# EAGLE board M7104B (EAGLE 6.6.0), part 1 of 3
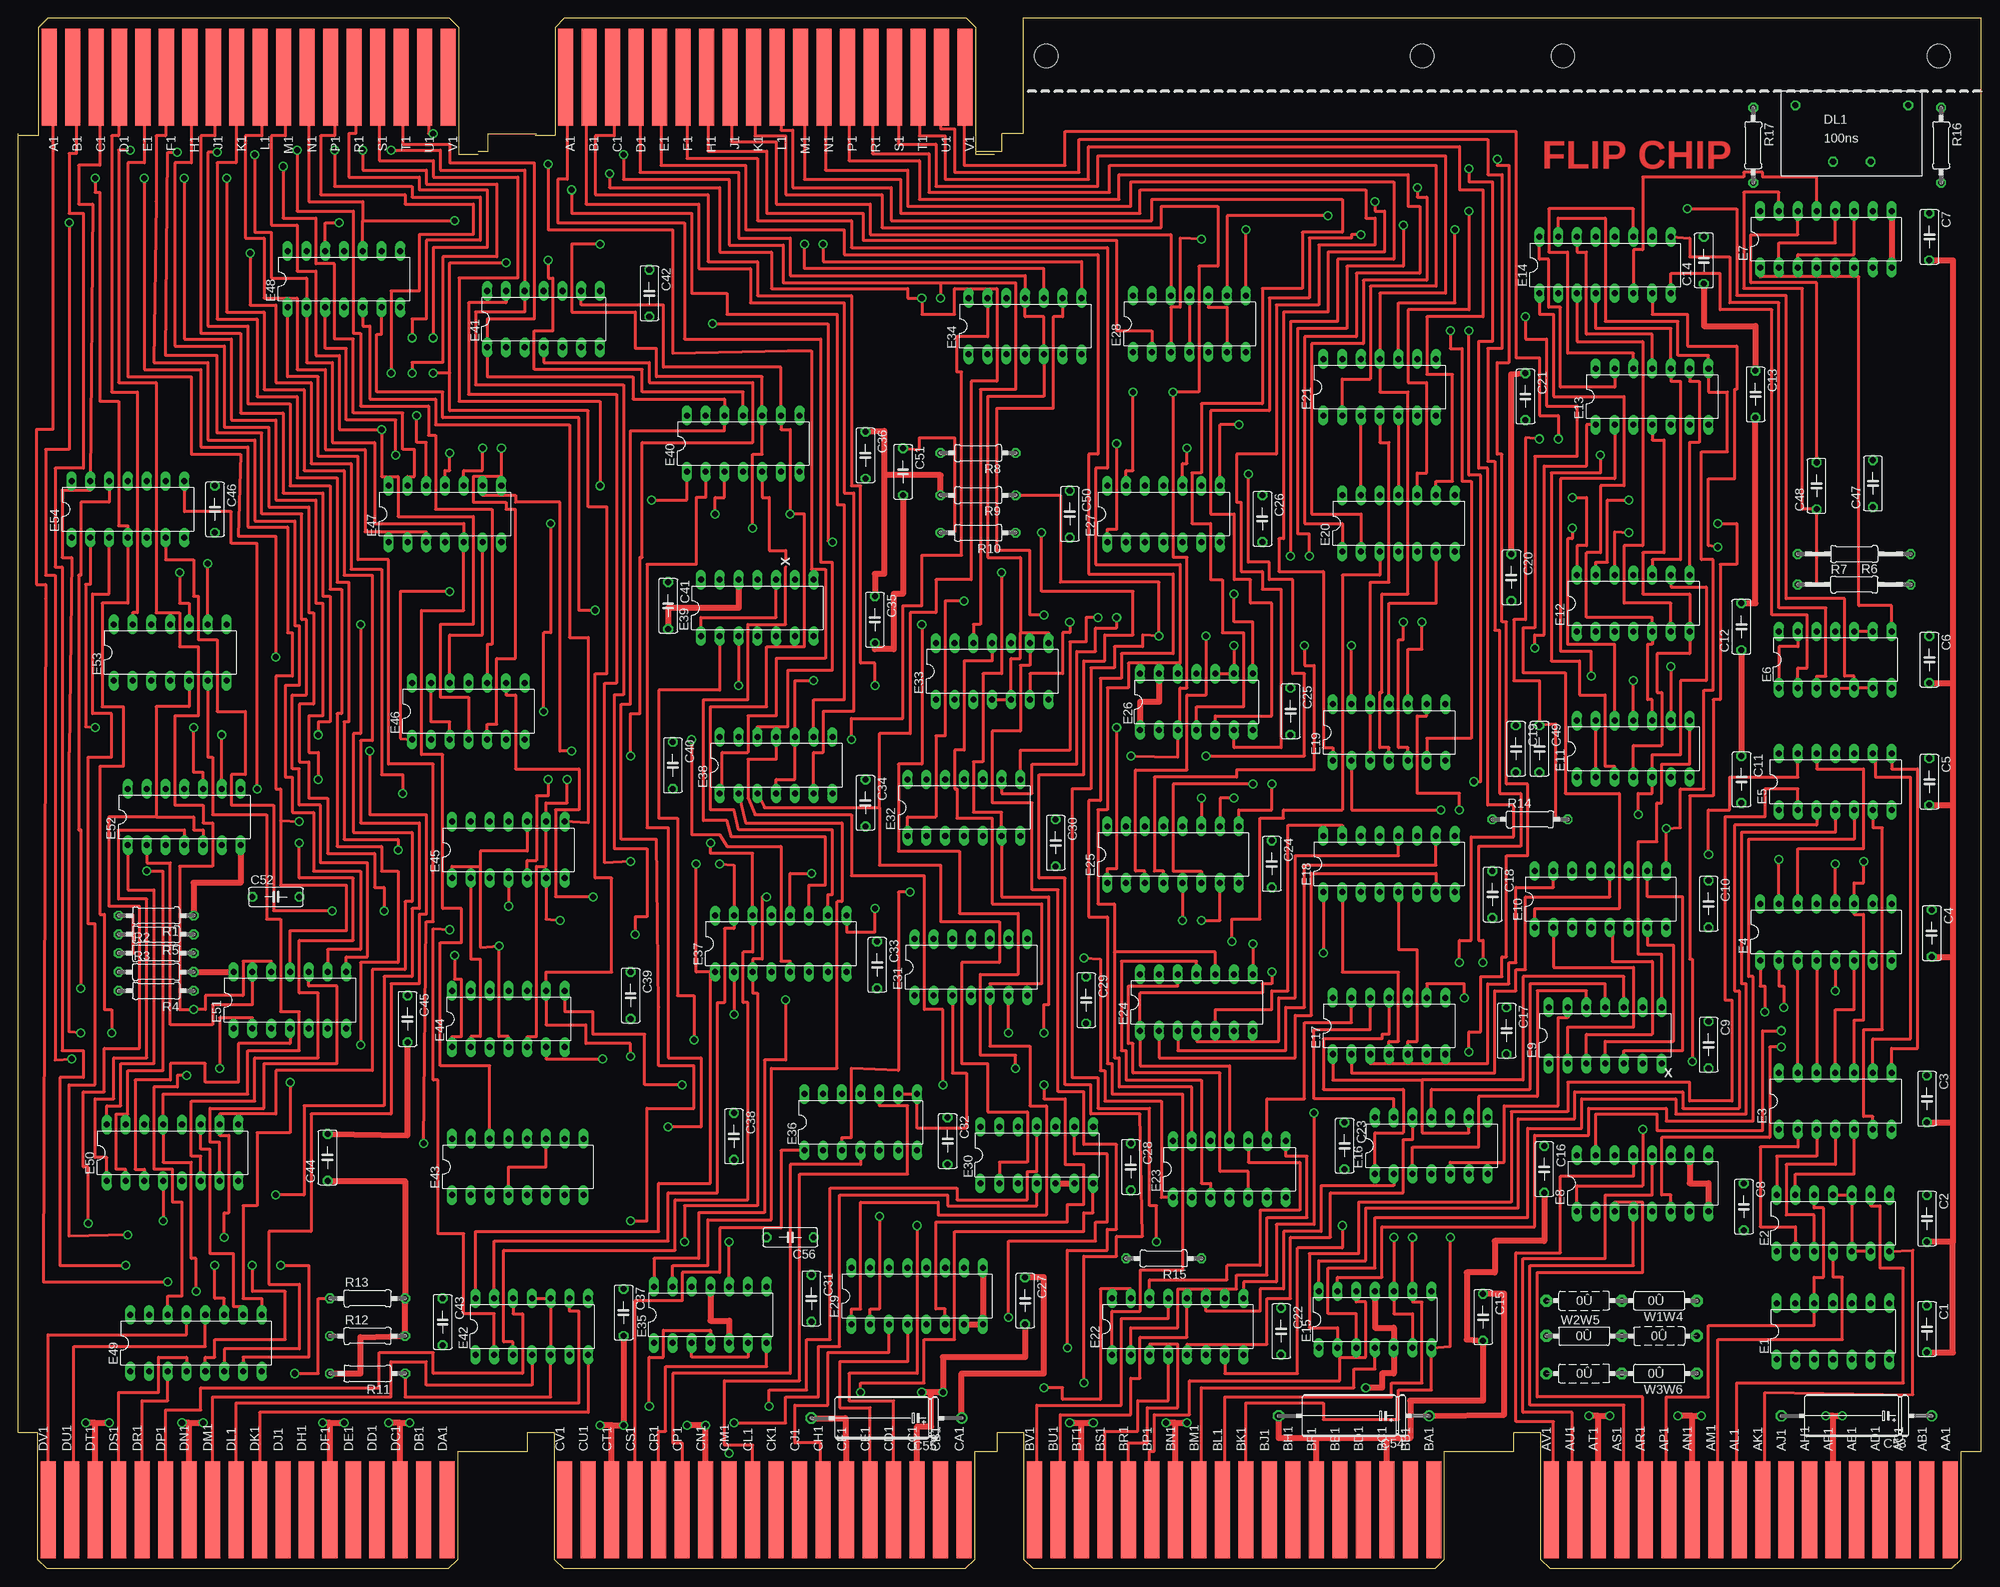
[diagram p5: board, top side]
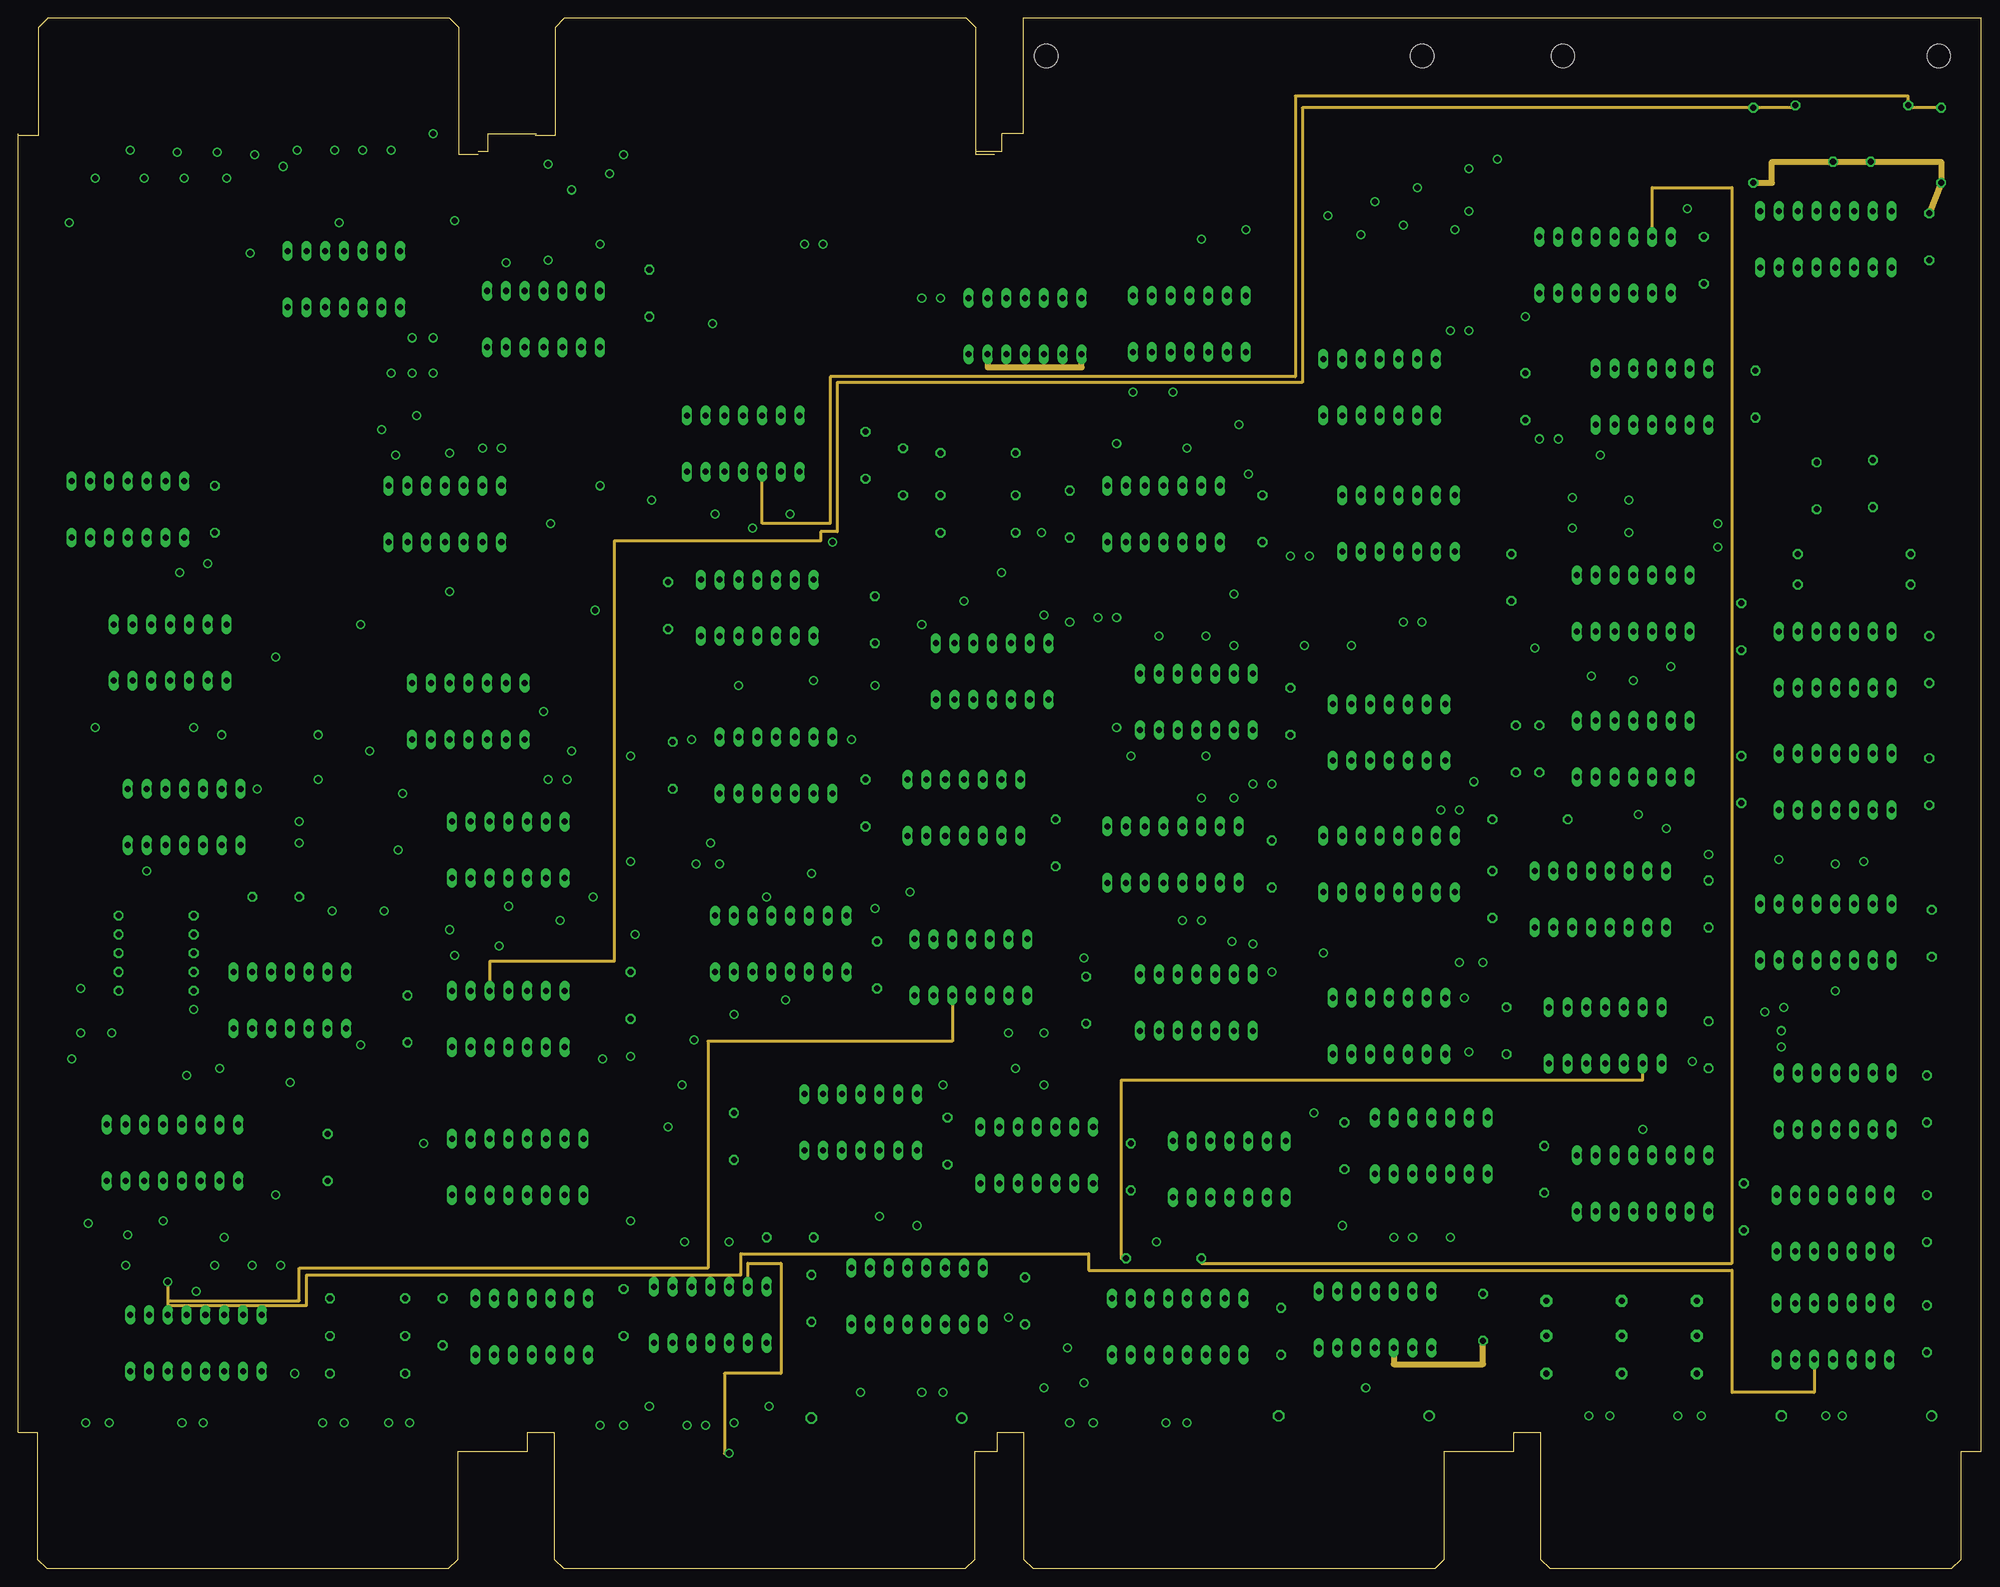
[diagram p6: board, inner layer ECO1]
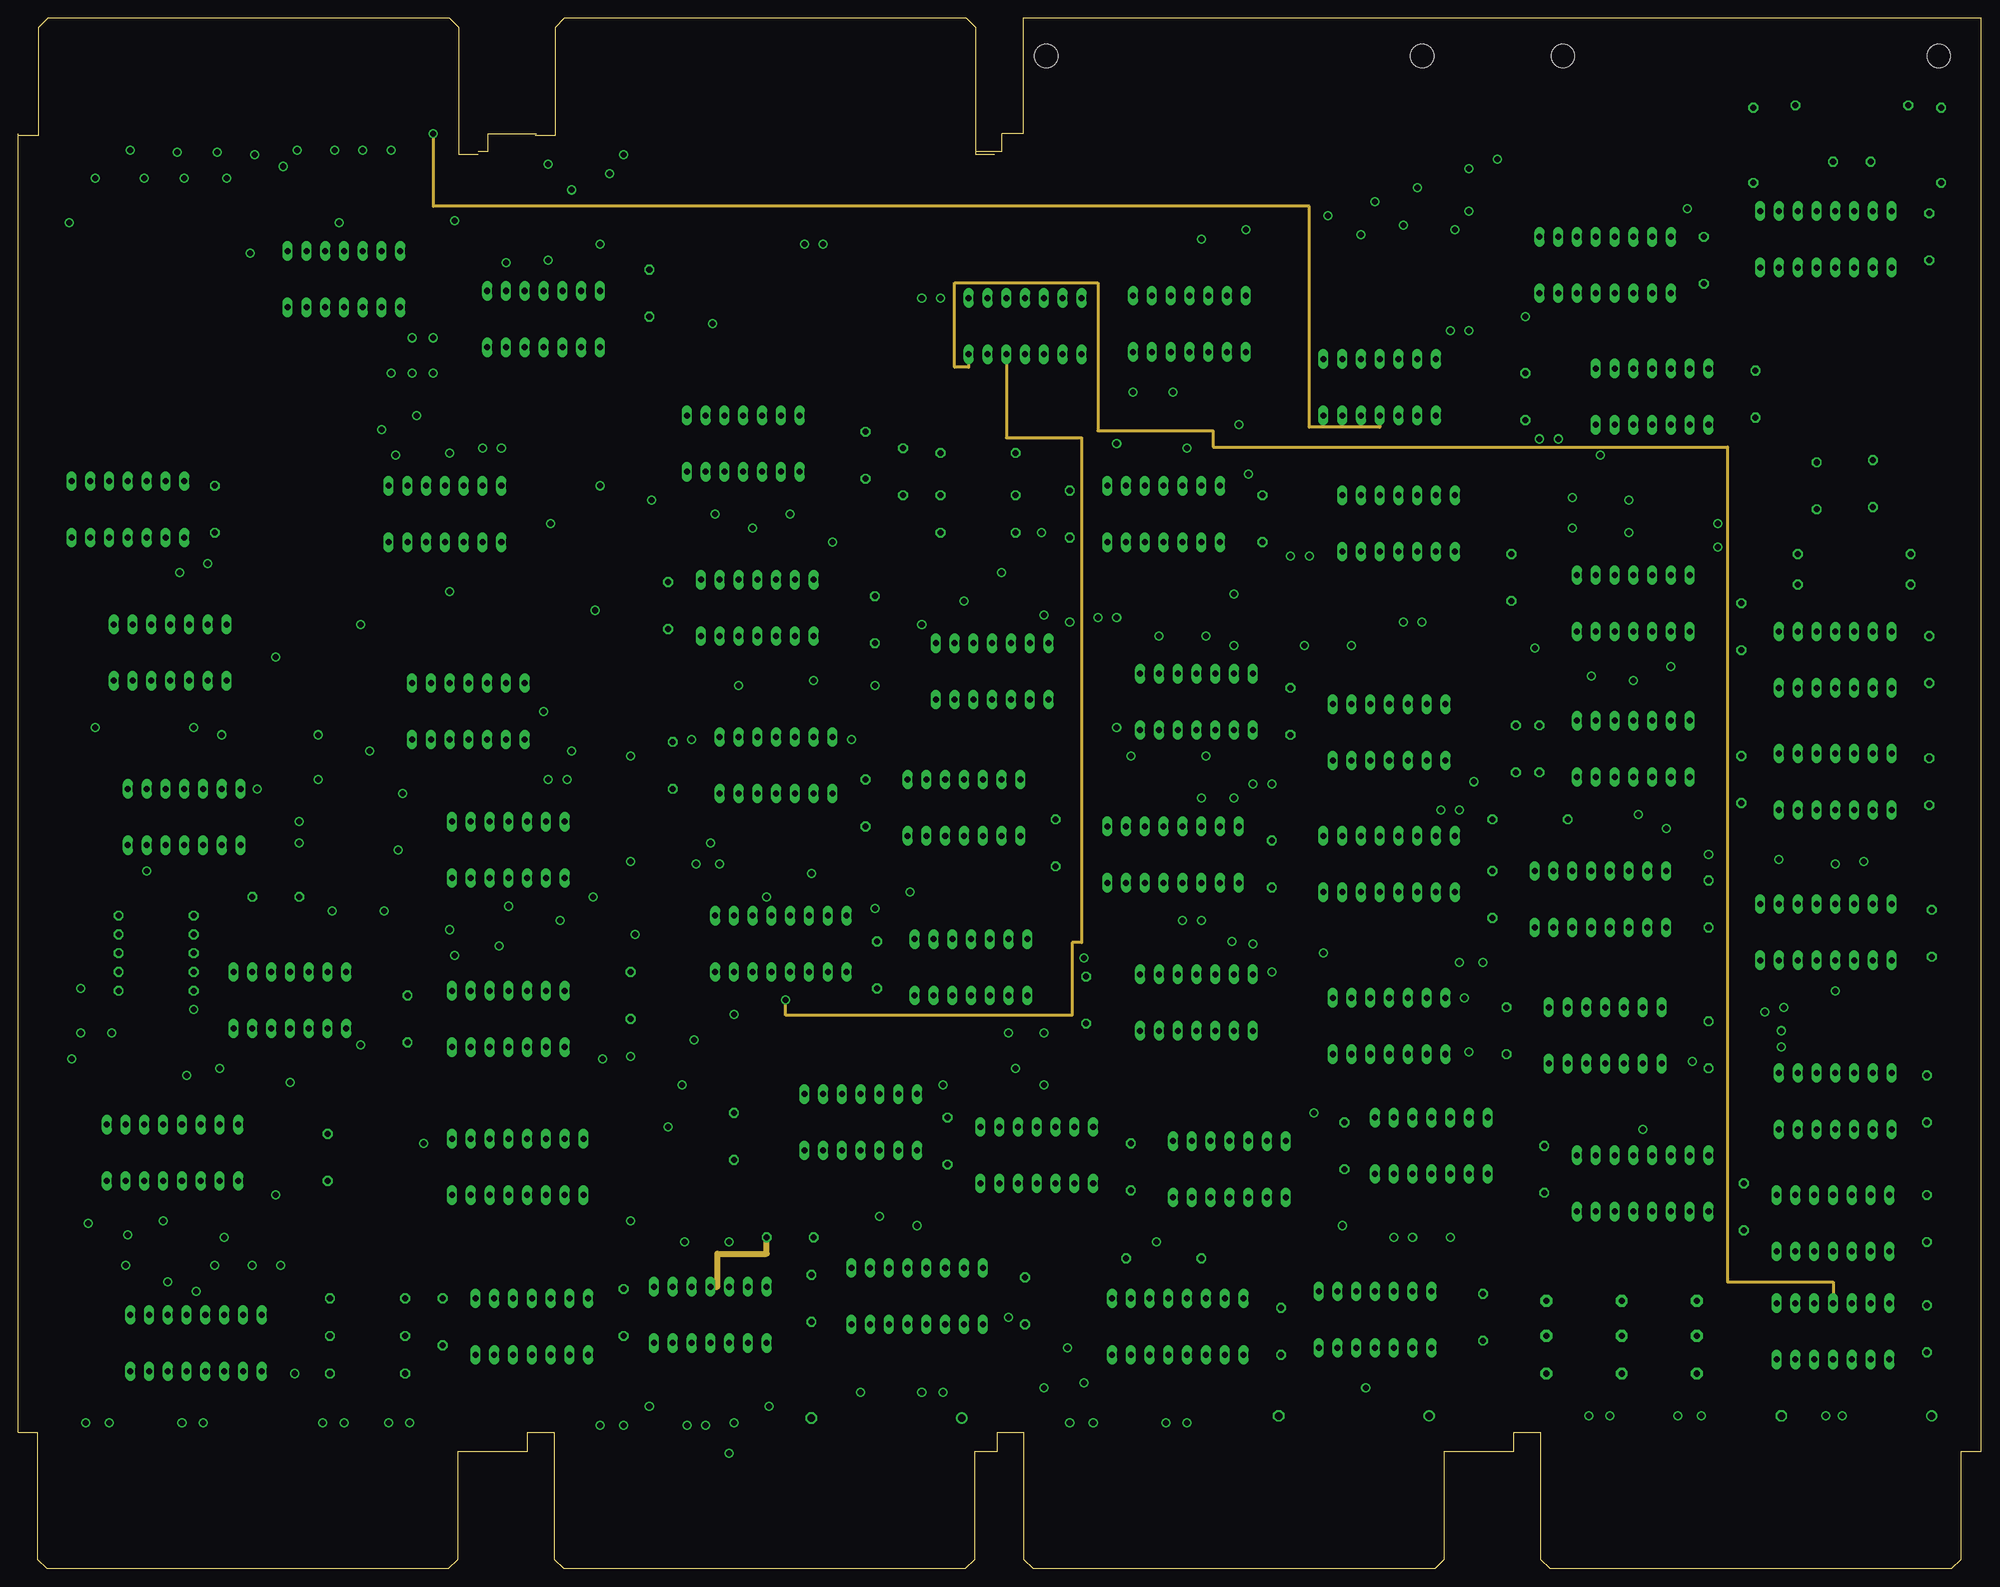
[diagram p7: board, inner layer ECO2]
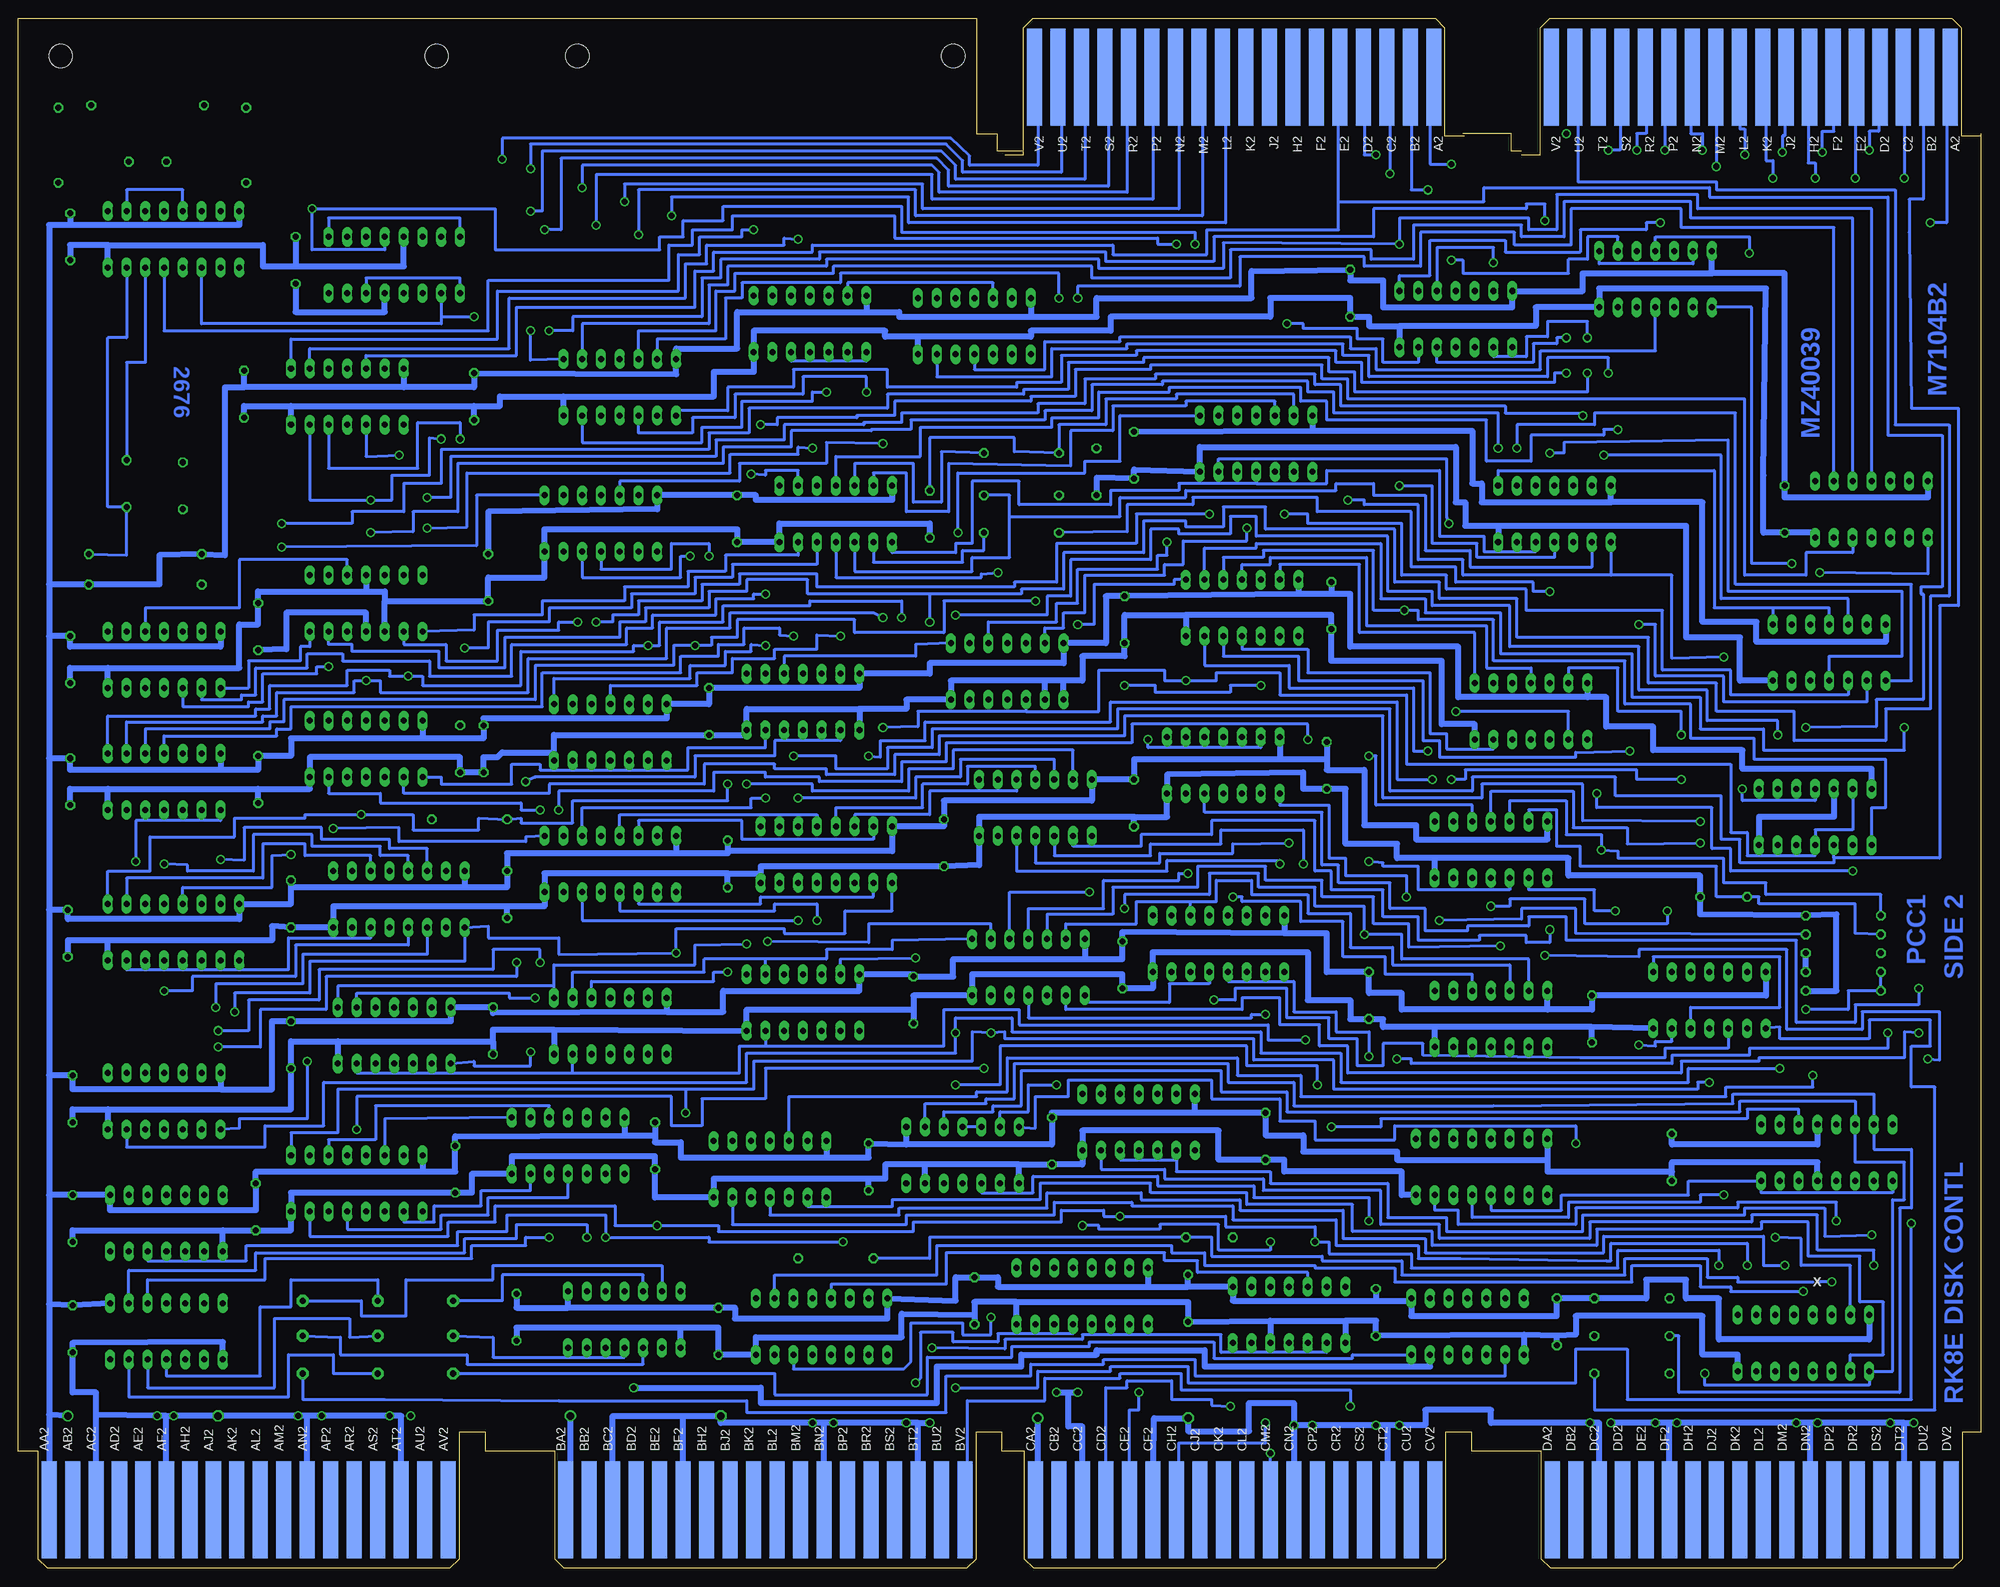
[diagram p8: board, bottom side, seen from below]

Size 265.3 x 209.55 mm. Coordinates in mm from the lower left corner, seen from the top.
Outline: 0,18.41 0,193.99
Outline: 129.41,191.61 132.97,191.61 132.97,193.99 135.76,193.99 135.76,209.55 265.3,209.55 265.3,15.88
Outline: 62.1,191.61 63.5,191.61 63.5,193.99 70.04,193.99
Copper layers (1+2+15+16): Top 0.035mm / dielectric 1.5mm / ECO1 0.035mm / dielectric 0.15mm / ECO2 0.035mm / dielectric 0.2mm / Bottom 0.035mm
Design rules "16mils *": minimum track width 16mil, minimum drill 32mil, track to track 15mil, track to pad 10mil, pad to pad 10mil, via to via 10mil, smd to smd 10mil, copper to edge 13mil, drill to drill 10mil, minimum pad ring 10mil, minimum via ring 8mil, stop-mask expansion 0mil, vias tented up to drill 0mil, thermal gap 10mil
Net classes: 1 supply: width 0.813 mm
Holes 3.17 mm at 138.94,204.47 189.74,204.47 208.79,204.47 259.59,204.47

## Footprints (pad centres in the part's own frame; a part is rotated, then mirrored left to right if it is on the bottom)
C063-025X075 = drill 0.813 octagon: 1 -2.54,0; 2 3.81,0
E12-8 = drill 1.016: + -10.16,0 | drill 1.016 octagon: - 10.16,0
RCL-L-XX-22 = drill 0.813 octagon: GND@1 6.35,1.27; GND@2 11.43,1.27; IN 1.27,8.89; OUT 16.51,8.89
DIL14 = drill 0.813 long: 1 -7.62,-3.81; 2 -5.08,-3.81; 3 -2.54,-3.81; 4 0,-3.81; 5 2.54,-3.81; 6 5.08,-3.81; 7 7.62,-3.81; 8 7.62,3.81; 9 5.08,3.81; 10 2.54,3.81; 11 0,3.81; 12 -2.54,3.81; 13 -5.08,3.81; 14 -7.62,3.81
DIL16 = drill 0.813 long: 1 -8.89,-3.81; 2 -6.35,-3.81; 3 -3.81,-3.81; 4 -1.27,-3.81; 5 1.27,-3.81; 6 3.81,-3.81; 7 6.35,-3.81; 8 8.89,-3.81; 9 8.89,3.81; 10 6.35,3.81; 11 3.81,3.81; 12 1.27,3.81; 13 -1.27,3.81; 14 -3.81,3.81; 15 -6.35,3.81; 16 -8.89,3.81
EDGE-CON2 = smd 13.106 x 2.032: A1 7.938,4.128; B1 7.938,7.303; C1 7.938,10.477; D1 7.938,13.652; E1 7.938,16.828; F1 7.938,20.003; H1 7.938,23.177; J1 7.938,26.352; K1 7.938,29.527; L1 7.938,32.703; M1 7.938,35.877; N1 7.938,39.053; P1 7.938,42.227; R1 7.938,45.403; S1 7.938,48.578; T1 7.938,51.752; U1 7.938,54.928; V1 7.938,58.102 | smd 13.106 x 2.032 bottom: A2 7.938,4.128; B2 7.938,7.303; C2 7.938,10.477; D2 7.938,13.652; E2 7.938,16.828; F2 7.938,20.003; H2 7.938,23.177; J2 7.938,26.352; K2 7.938,29.527; L2 7.938,32.703; M2 7.938,35.877; N2 7.938,39.053; P2 7.938,42.227; R2 7.938,45.403; S2 7.938,48.578; T2 7.938,51.752; U2 7.938,54.928; V2 7.938,58.102
EDGE-CON8 = smd 2.032 x 13.106: AA1 261.303,7.938; AB1 258.127,7.938; AC1 254.952,7.938; AD1 251.778,7.938; AE1 248.602,7.938; AF1 245.428,7.938; AH1 242.252,7.938; AJ1 239.077,7.938; AK1 235.903,7.938; AL1 232.727,7.938; AM1 229.553,7.938; AN1 226.377,7.938; AP1 223.202,7.938; AR1 220.028,7.938; AS1 216.852,7.938; AT1 213.678,7.938; AU1 210.502,7.938; AV1 207.327,7.938; BA1 191.452,7.938; BB1 188.278,7.938; BC1 185.102,7.938; BD1 181.928,7.938; BE1 178.752,7.938; BF1 175.577,7.938; BH1 172.403,7.938; BJ1 169.227,7.938; BK1 166.053,7.938; BL1 162.877,7.938; BM1 159.702,7.938; BN1 156.528,7.938; BP1 153.352,7.938; BR1 150.178,7.938; BS1 147.002,7.938; BT1 143.827,7.938; BU1 140.653,7.938; BV1 137.477,7.938; CA1 127.953,7.938; CB1 124.778,7.938; CC1 121.603,7.938; CD1 118.427,7.938; CE1 115.252,7.938; CF1 112.078,7.938; CH1 108.903,7.938; CJ1 105.728,7.938; CK1 102.552,7.938; CL1 99.377,7.938; CM1 96.203,7.938; CN1 93.028,7.938; CP1 89.853,7.938; CR1 86.677,7.938; CS1 83.502,7.938; CT1 80.328,7.938; CU1 77.153,7.938; CV1 73.978,7.938; DA1 58.102,7.938; DB1 54.928,7.938; DC1 51.752,7.938; DD1 48.578,7.938; DE1 45.403,7.938; DF1 42.227,7.938; DH1 39.053,7.938; DJ1 35.877,7.938; DK1 32.703,7.938; DL1 29.527,7.938; DM1 26.352,7.938; DN1 23.177,7.938; DP1 20.003,7.938; DR1 16.828,7.938; DS1 13.652,7.938; DT1 10.477,7.938; DU1 7.303,7.938; DV1 4.128,7.938 | smd 2.032 x 13.106 bottom: AA2 261.303,7.938; AB2 258.127,7.938; AC2 254.952,7.938; AD2 251.778,7.938; AE2 248.602,7.938; AF2 245.428,7.938; AH2 242.252,7.938; AJ2 239.077,7.938; AK2 235.903,7.938; AL2 232.727,7.938; AM2 229.553,7.938; AN2 226.377,7.938; AP2 223.202,7.938; AR2 220.028,7.938; AS2 216.852,7.938; AT2 213.678,7.938; AU2 210.502,7.938; AV2 207.327,7.938; BA2 191.452,7.938; BB2 188.278,7.938; BC2 185.102,7.938; BD2 181.928,7.938; BE2 178.752,7.938; BF2 175.577,7.938; BH2 172.403,7.938; BJ2 169.227,7.938; BK2 166.053,7.938; BL2 162.877,7.938; BM2 159.702,7.938; BN2 156.528,7.938; BP2 153.352,7.938; BR2 150.178,7.938; BS2 147.002,7.938; BT2 143.827,7.938; BU2 140.653,7.938; BV2 137.477,7.938; CA2 127.953,7.938; CB2 124.778,7.938; CC2 121.603,7.938; CD2 118.427,7.938; CE2 115.252,7.938; CF2 112.078,7.938; CH2 108.903,7.938; CJ2 105.728,7.938; CK2 102.552,7.938; CL2 99.377,7.938; CM2 96.203,7.938; CN2 93.028,7.938; CP2 89.853,7.938; CR2 86.677,7.938; CS2 83.502,7.938; CT2 80.328,7.938; CU2 77.153,7.938; CV2 73.978,7.938; DA2 58.102,7.938; DB2 54.928,7.938; DC2 51.752,7.938; DD2 48.578,7.938; DE2 45.403,7.938; DF2 42.227,7.938; DH2 39.053,7.938; DJ2 35.877,7.938; DK2 32.703,7.938; DL2 29.527,7.938; DM2 26.352,7.938; DN2 23.177,7.938; DP2 20.003,7.938; DR2 16.828,7.938; DS2 13.652,7.938; DT2 10.477,7.938; DU2 7.303,7.938; DV2 4.128,7.938
0207/10 = drill 0.813 octagon: 1 -5.08,0; 2 5.08,0
0207/15 = drill 0.813 octagon: 1 -7.62,0; 2 7.62,0
0R2/10 = drill 0.813 pad 1.6 octagon: 1 -5.08,0; 2 5.08,0; 3 15.24,0

## Placement (x,y rotation side)
C1  .01uF  [C063-025X075]  258,33.02 270 top
C2  .01uF  [C063-025X075]  258,47.94 270 top
C3  .01uF  [C063-025X075]  258,64.14 270 top
C4  .01uF  [C063-025X075]  258.64,86.52 270 top
C5  .01uF  [C063-025X075]  258.32,107 270 top
C6  .01uF  [C063-025X075]  258.32,123.51 270 top
C7  .01uF  [C063-025X075]  258.32,180.66 270 top
C8  .01uF  [C063-025X075]  233.24,49.53 270 top
C9  .01uF  [C063-025X075]  228.47,71.44 270 top
C10  .01uF  [C063-025X075]  228.47,90.49 270 top
C11  .01uF  [C063-025X075]  232.92,107.31 270 top
C12  .01uF  [C063-025X075]  232.92,126.68 90 top
C13  .01uF  [C063-025X075]  234.82,159.38 270 top
C14  .01uF  [C063-025X075]  227.84,176.21 90 top
C15  .01uF  [C063-025X075]  197.99,34.61 270 top
C16  .01uF  [C063-025X075]  206.25,54.61 270 top
C17  .01uF  [C063-025X075]  201.17,73.34 270 top
C18  .01uF  [C063-025X075]  199.26,91.76 270 top
C19  .01uF  [C063-025X075]  202.44,111.44 270 top
C20  .01uF  [C063-025X075]  201.8,134.62 270 top
C21  .01uF  [C063-025X075]  203.71,159.07 270 top
C22  .01uF  [C063-025X075]  170.69,32.7 270 top
C23  .01uF  [C063-025X075]  179.26,57.78 270 top
C24  .01uF  [C063-025X075]  169.42,95.89 270 top
C25  .01uF  [C063-025X075]  171.96,116.52 270 top
C26  .01uF  [C063-025X075]  168.15,142.56 270 top
C27  .01uF  [C063-025X075]  136.08,36.83 270 top
C28  .01uF  [C063-025X075]  150.37,54.93 270 top
C29  .01uF  [C063-025X075]  144.34,77.47 270 top
C30  .01uF  [C063-025X075]  140.21,98.74 270 top
C31  .01uF  [C063-025X075]  107.19,37.15 270 top
C32  .01uF  [C063-025X075]  125.6,58.42 270 top
C33  .01uF  [C063-025X075]  116.08,82.23 270 top
C34  .01uF  [C063-025X075]  114.49,104.14 270 top
C35  .01uF  [C063-025X075]  115.76,128.91 270 top
C36  .01uF  [C063-025X075]  114.49,151.13 270 top
C37  .01uF  [C063-025X075]  81.79,35.24 270 top
C38  .01uF  [C063-025X075]  96.71,59.05 270 top
C39  .01uF  [C063-025X075]  82.74,78.11 270 top
C40  .01uF  [C063-025X075]  88.46,109.22 270 top
C41  .01uF  [C063-025X075]  87.82,130.81 270 top
C42  .01uF  [C063-025X075]  85.28,173.04 270 top
C43  .01uF  [C063-025X075]  57.34,33.97 270 top
C44  .01uF  [C063-025X075]  41.78,54.93 90 top
C45  .01uF  [C063-025X075]  52.58,74.93 270 top
C46  .01uF  [C063-025X075]  26.54,143.83 270 top
C47  39pF  [C063-025X075]  250.7,146.05 90 top
C48  10pF  [C063-025X075]  243.08,145.73 90 top
C49  470pF  [C063-025X075]  205.61,111.44 270 top
C50  180pF  [C063-025X075]  142.11,143.19 270 top
C51  330pF  [C063-025X075]  119.57,148.91 270 top
C52  180pF  [C063-025X075]  34.16,90.81 0 top
C53  6.8uF  [E12-8]  248.48,20.64 180 top
C54  6.8uF  [E12-8]  180.53,20.64 180 top
C55  6.8uF  [E12-8]  117.35,20.32 180 top
C56  470pF  [C063-025X075]  104.97,44.77 180 top
DL1  100ns  [RCL-L-XX-22]  238.95,188.91 0 top
E1  SP314N  [DIL14]  245.3,32.07 0 top
E2  DS8640N  [DIL14]  245.3,46.67 0 top
E3  7495N  [DIL14]  245.62,63.18 0 top
E4  74174N  [DIL16]  244.35,86.04 0 top
E5  7495N  [DIL14]  245.62,106.36 0 top
E6  74H53N  [DIL14]  245.62,122.87 0 top
E7  74123N  [DIL16]  244.35,179.71 0 top
E8  DEC8235  [DIL16]  219.58,52.07 0 top
E9  7495N  [DIL14]  214.5,72.07 0 top
E10  74174N  [DIL16]  213.87,90.49 0 top
E11  7408N  [DIL14]  218.31,110.81 0 top
E12  7473N  [DIL14]  218.31,130.49 0 top
E13  7402N  [DIL14]  220.85,158.43 0 top
E14  7476N  [DIL16]  214.5,176.21 0 top
E15  DS8640N  [DIL14]  183.39,33.66 0 top
E16  7404N  [DIL14]  191.01,57.15 0 top
E17  7495N  [DIL14]  185.29,73.34 0 top
E18  74174N  [DIL16]  185.29,95.25 0 top
E19  7402N  [DIL14]  185.29,113.03 0 top
E20  74H00N  [DIL14]  186.56,141.29 0 top
E21  74H04N  [DIL14]  184.02,159.7 0 top
E22  DEC8235  [DIL16]  156.72,32.7 0 top
E23  7404N  [DIL14]  163.7,53.98 0 top
E24  7495N  [DIL14]  159.26,76.52 0 top
E25  74174N  [DIL16]  156.08,96.52 0 top
E26  74H53N  [DIL14]  159.26,117.16 0 top
E27  7404N  [DIL14]  154.81,142.56 0 top
E28  7402N  [DIL14]  158.31,168.28 0 top
E29  DEC8235  [DIL16]  121.48,36.83 0 top
E30  SP384N  [DIL14]  137.67,55.88 0 top
E31  7404N  [DIL14]  128.78,81.28 0 top
E32  7495N  [DIL14]  127.83,102.87 0 top
E33  7437N  [DIL14]  131.64,121.28 0 top
E34  7402N  [DIL14]  136.08,167.96 0 top
E35  DS8640N  [DIL14]  93.54,34.29 0 top
E36  N8881N  [DIL14]  113.86,60.33 0 top
E37  DEC8251  [DIL16]  103.06,84.45 0 top
E38  74H74N  [DIL14]  102.43,108.58 0 top
E39  7474N  [DIL14]  99.89,129.86 0 top
E40  7408N  [DIL14]  97.98,152.08 0 top
E41  7440N  [DIL14]  70.99,168.91 0 top
E42  DS8640N  [DIL14]  69.41,32.7 0 top
E43  74193N  [DIL16]  67.5,54.29 0 top
E44  7440N  [DIL14]  66.23,74.3 0 top
E45  7400N  [DIL14]  66.23,97.16 0 top
E46  7400N  [DIL14]  60.83,115.89 0 top
E47  7410N  [DIL14]  57.66,142.56 0 top
E48  7408N  [DIL14]  44.01,174.31 0 top
E49  DEC8235  [DIL16]  24,30.48 0 top
E50  7496N  [DIL16]  20.83,56.2 0 top
E51  7402N  [DIL14]  36.7,76.83 0 top
E52  7474N  [DIL14]  22.42,101.6 0 top
E53  7402N  [DIL14]  20.51,123.83 0 top
E54  7400N  [DIL14]  14.8,143.19 0 top
H  EDGE-TOP  [EDGE-CON2]  69.85,209.55 270 top
J  EDGE-TOP  [EDGE-CON2]  0,209.55 270 top
OMNIBUS  QUAD  [EDGE-CON8]  -0.13,0 0 top
R1  390  [0207/10]  18.61,88.27 180 top
R2  180  [0207/10]  18.61,83.19 0 top
R3  180  [0207/10]  18.61,80.64 0 top
R4  390  [0207/10]  18.61,78.11 180 top
R5  100  [0207/10]  18.61,85.72 180 top
R6  5.11K  [0207/15]  248.16,137.16 180 top
R7  5.11K  [0207/15]  248.16,133.03 0 top
R8  100  [0207/10]  129.73,150.81 180 top
R9  2.2K  [0207/10]  129.73,145.1 180 top
R10  100  [0207/10]  129.73,140.02 180 top
R11  1.8K  [0207/10]  47.18,26.35 180 top
R12  4.7K  [0207/10]  47.18,31.43 0 top
R13  4.7K  [0207/10]  47.18,36.51 0 top
R14  100  [0207/10]  204.34,101.28 0 top
R15  100  [0207/10]  154.81,41.91 180 top
R16  1K  [0207/10]  259.91,192.41 270 top
R17  1K  [0207/10]  234.51,192.41 270 top
W1W4  [0R2/10]  221.81,36.2 180 top
W2W5  [0R2/10]  211.65,31.43 0 top
W3W6  [0R2/10]  221.81,26.35 180 top

## Tracks (layer width: path | path; a pad name or v marks a point on that pad's centre or on a via)
0_DB4  (via drill 0.81 pad 0.41)
  Top 0.406: E6.4 E6.5 | E6.6 E6.5 | E34.10 138.62,175.74 106.23,175.74 v106.23,179.07 | v225.62,183.83 232.28,183.83 232.28,172.09 238.95,172.09 238.95,131.13 246.89,131.13 246.89,120.65 248.16,120.65 E6.5
  Bottom 0.406: E14.12 215.77,178.28 225.62,178.28 v225.62,183.83 200.85,183.83 200.85,178.28 178.62,178.28 178.62,180.02 175.45,180.02 175.45,182.25 170.05,182.25 170.05,184.15 145.92,184.15 145.92,180.66 106.23,180.66 v106.23,179.07
1_DB2
  Top 0.406: E6.13 240.54,124.62 238,124.62 E6.1 | E13.4 220.85,152.56 222.44,152.56 222.44,137.32 219.58,137.32 219.58,131.76 225.93,131.76 E12.7 225.93,123.67 221.49,123.67 221.49,118.43 222.12,118.43 222.12,111.28 218.31,111.28 E11.4
  Bottom 0.406: E6.1 234.19,119.06 234.19,122.71 227.2,122.71 227.2,124.62 225.93,124.62 E12.7
1_DB3
  Top 0.406: E6.9 E6.10 | E14.4 213.23,167.64 223.39,167.64 E13.10 223.39,160.5 224.66,160.5 224.66,136.37 220.85,136.37 E12.10
  Bottom 0.406: E12.10 220.85,136.37 235.46,136.37 235.46,129.86 248.16,129.86 E6.10
1_DB4  (via drill 0.81 pad 0.41)
  Top 0.406: v223.39,121.92 E11.9 | E13.13 215.77,159.7 208.47,159.7 208.47,170.5 206.88,170.5 206.88,177.01 205.61,177.01 E14.16 | E14.9 225.93,179.86 225.93,177.32 231.33,177.32 231.33,171.13 238,171.13 238,129.86 244.35,129.86 244.35,120.65 243.08,120.65 E6.3
  Bottom 0.406: E14.16 205.61,182.56 223.39,182.56 E14.9 | E6.3 243.08,116.52 234.19,116.52 234.19,117.16 232.28,117.16 232.28,120.97 224.98,120.97 224.98,121.92 v223.39,121.92
6RK1  (via drill 0.81 pad 0.41)
  Top 0.406: v120.52,91.44 118.94,91.44 118.94,67.31 112.59,67.63 112.59,58.26 111.31,58.26 E36.3
  Bottom 0.406: E31.10 131.32,91.44 v120.52,91.44
6RK2  (via drill 0.81 pad 0.41)
  Top 0.406: E44.4 66.23,71.91 64.96,71.91 v64.96,84.14 62.42,83.98 62.42,94.93 | E41.4 70.99,163.04 85.28,163.04 85.28,160.34 99.25,160.34 99.25,152.24 84.33,152.24 84.33,136.68 84.01,136.68 84.01,115.57 82.74,115.57 v82.74,109.86 | E45.1 58.61,94.93 62.42,94.93 | E45.10 68.77,97 62.42,97 62.42,94.93
  Bottom 0.406: v64.96,84.14 77.34,83.98 77.34,87.15 82.11,87.15 82.11,90.81 89.09,90.81 89.09,93.03 96.71,93.03 96.71,94.93 105.92,94.93 105.92,92.08 117.35,92.08 117.35,88.42 126.24,88.42 E31.12 | E45.10 68.77,103.19 81.79,103.19 81.79,109.86 v82.74,109.86
6RK3_OK
  Top 0.406: E19.4 185.29,110.97 184.02,110.97 184.02,118.43 184.34,118.43 184.34,131.76 187.83,131.76 187.83,159.07 184.02,159.07 E21.11 184.02,172.4 192.91,172.4 192.91,190.98 145.92,190.98 145.92,186.85 124.02,186.85 124.02,192.56 118.94,192.56 118.94,201.77 H.S1
6RK6
  Top 0.406: H.R1 115.44,201.77 115.44,191.29 123.06,191.29 123.06,186.06 147.51,186.06 147.51,189.71 191.64,189.71 191.64,173.35 182.75,173.35 182.75,160.81 178.94,160.81 E21.2
6RK7  (via drill 0.81 pad 0.41)
  Top 0.406: J.C1 10.99,198.12 10.99,189.71 8.13,189.71 8.13,184.47 10.03,184.47 E54.13 9.71,145.73 5.91,145.73 5.91,136.68 7.18,136.68 6.86,110.33 6.86,72.55 v8.44,72.39
  Bottom 0.406: v8.44,72.39 10.35,72.55 10.35,69.06 30.04,69.06 30.04,68.58 40.51,68.58 40.51,66.99 85.6,66.99 85.6,70.64 89.41,70.64 89.41,73.5 94.81,73.5 94.81,77.15 99.89,77.15 99.89,75.56 123.7,75.56 E31.2
6RK7_OK  (via drill 0.81 pad 0.41)
  Top 0.406: v183.39,184.78 183.39,183.51 184.66,183.51 184.66,177.96 177.04,177.96 177.04,169.86 171,169.86 171,139.22 170.37,139.22 170.37,134.78 176.4,134.78 176.4,110.97 177.67,110.97 E19.1
  Bottom 0.406: H.N2 108.46,200.18 108.46,183.83 143.06,183.83 143.06,187.17 183.39,187.17 v183.39,184.78
12TH_BIT_OK
  Top 0.406: H.M1 106.23,201.77 106.23,187.8 119.25,187.8 119.25,183.2 151.64,183.2 151.64,186.37 182.12,186.37 182.12,182.56 183.39,182.56 183.39,178.91 175.77,178.91 175.77,170.81 170.05,170.81 170.05,150.65 164.66,150.65 164.66,144.15 165.29,144.15 165.29,134.78 168.15,134.78 168.15,132.4 170.69,132.4 170.69,110.97 164.34,110.97 E26.6
  Bottom 0.406: E11.1 208.15,107 208.15,106.05 198.63,106.05 198.63,108.74 194.82,108.74 194.82,107.95 174.81,107.95 174.81,110.97 164.34,110.97 E26.6
!6RK1  (via drill 0.81 pad 0.41)
  Top 0.406: E37.12 104.33,93.98 v107.19,93.98
  Bottom 0.406: E31.11 128.78,89.22 118.62,89.22 118.62,93.03 108.46,93.03 108.46,93.98 v107.19,93.98
!6RK2
  Top 0.406: E37.11 106.87,92.39 109.09,92.39 109.09,98.9 96.39,98.9 95.76,101.12 92.58,101.12 92.58,117.47 98.62,117.47 98.62,127.64 103.7,127.64 103.7,135.41
  ECO1 0.406: DL1.IN 239.9,197.49 R17.1 173.55,197.49 173.55,160.34 110.68,160.34 110.68,140.18 108.46,140.18 108.46,138.91 80.52,138.91 80.52,82.07 63.69,82.07 E44.12
  Bottom 0.406: E31.13 123.7,87.15 114.17,87.15 114.17,90.17 106.87,90.17 | 106.87,90.17 103.38,90.17 103.38,93.03 98.62,93.03 98.62,91.12 91,91.12 91,88.58 85.28,88.58 85.28,83.98 79.56,83.98 79.56,81.6 63.69,81.6 E44.12 | E37.11 106.87,90.17
!6RK3  (via drill 0.81 pad 0.41)
  Top 0.406: E41.9 76.07,170.81 87.19,170.81 87.19,162.4 103.06,162.4 E40.9 103.06,153.99 104.33,153.99 v104.33,142.56 106.23,142.56 106.23,124.62 101.16,124.62 101.16,116.52 93.54,116.52 93.54,102.55 96.71,102.55 97.34,99.85 110.05,99.85 110.05,91.12 109.41,91.12 E37.10 | E19.5 187.83,110.97 186.56,110.97 186.56,125.57 187.2,125.57 v187.2,127.95
  Bottom 0.406: v104.33,142.56 114.17,142.56 114.17,138.59 124.97,138.59 124.97,133.35 130.68,133.35 130.68,132.72 157.35,132.72 157.35,134.46 167.83,134.46 167.83,133.03 172.91,133.03 172.91,130.81 181.48,130.81 181.48,128.91 184.97,128.91 184.97,127.95 v187.2,127.95
!6RK3_OK  (via drill 0.81 pad 0.41)
  Top 0.406: E21.10 186.56,171.13 194.18,171.13 v194.18,180.97
  Bottom 0.406: H.S2 117.98,197.8 117.98,186.85 139.57,186.85 139.57,189.07 141.16,190.66 191.96,190.66 191.96,180.97 v194.18,180.97
!6RK4  (via drill 0.81 pad 0.41)
  Top 0.406: v50.36,191.77 57.02,191.77 57.02,189.07 68.45,189.07 E41.12 68.45,169.86 61.79,169.86 61.79,160.02 81.79,160.02 81.79,118.11 80.52,118.11 80.52,97.31 84.96,97.31 84.96,88.11 83.38,88.11 v83.38,85.72 | E37.9 111.95,86.04 115.76,86.04 v115.76,89.22
  Bottom 0.406: J.S2 48.77,196.85 48.77,191.77 v50.36,191.77 | E44.13 61.15,82.39 78.3,82.39 78.3,85.72 v83.38,85.72 83.38,89.53 90.04,89.53 90.04,92.08 97.66,92.08 97.66,93.98 104.33,93.98 104.33,91.12 115.76,91.12 v115.76,89.22
!6RK5  (via drill 0.81 pad 0.41)
  Top 0.406: v35.43,40.96 39.24,40.96 39.24,28.57 30.35,28.57 E49.7 | v90.04,44.13 90.04,49.05 99.89,49.05 99.89,77.79 99.25,77.79 E37.3 99.25,82.39 100.52,82.39 100.52,90.81 v101.16,90.81 | E29.2 115.12,35.08 116.4,35.08 v116.4,47.62 | E22.7 163.07,26.35 172.91,26.35 172.91,43.34 178.94,43.34 v178.94,46.35
  Bottom 0.406: E8.7 225.93,44.93 207.2,44.93 207.2,46.83 200.85,46.83 200.85,49.05 184.66,49.05 184.66,46.35 v178.94,46.35 170.69,46.35 170.69,45.56 144.34,45.56 144.34,46.83 124.33,46.83 124.33,48.42 118.62,48.42 118.62,47.62 v116.4,47.62 102.11,47.62 102.11,46.2 90.04,46.2 v90.04,44.13 88.14,44.13 88.14,42.55 77.03,42.55 77.03,40.64 49.09,40.64 49.09,43.02 35.43,43.02 v35.43,40.96 | E44.10 68.77,80.33 80.52,80.33 80.52,82.71 86.23,82.71 86.23,87.47 91.95,87.47 91.95,90.17 99.89,90.17 99.89,90.81 v101.16,90.81
!6RK6  (via drill 0.81 pad 0.41)
  Top 0.406: 58.29,161.61 58.29,156.53 77.03,156.53 77.03,143.51 79.56,143.51 79.56,120.97 77.98,120.97 77.98,93.34 80.2,93.34 80.2,80.64 71.31,80.64 E44.9 71.31,73.5 76.71,73.5 76.71,70.96 82.74,70.96 v82.74,69.22 | 58.29,161.61 v56.07,161.61 | 58.29,161.61 58.29,176.53 v65.91,176.53
  Bottom 0.406: E37.4 101.79,79.38 92.9,79.38 92.9,75.25 87.19,75.25 87.19,72.55 82.74,72.55 v82.74,69.22 | E21.1 176.4,156.53 169.42,156.53 169.42,159.7 160.53,159.7 160.53,162.08 147.83,162.08 147.83,159.7 130.37,159.7 130.37,160.34 124.33,160.34 124.33,163.99 114.17,163.99 114.17,164.62 87.19,164.62 87.19,163.04 83.69,163.04 83.69,160.34 57.66,160.34 57.66,161.61 v56.07,161.61 | v65.91,176.53 65.91,178.59 73.53,178.59 E41.10
!6RK7  (via drill 0.81 pad 0.41)
  Top 0.406: E19.2 180.21,102.55 v192.28,102.55 | v91,112.08 91,99.22 94.81,99.22 95.76,97.63 103.06,97.63 103.06,82.07 104.33,82.07 E37.5
  Bottom 0.406: E37.5 104.33,79.06 109.73,79.06 109.73,76.52 121.16,76.52 E31.1 | v91,112.08 91,114.14 114.81,114.14 114.81,111.6 139.89,111.6 139.89,109.06 145.92,109.06 145.92,106.36 157.03,106.36 157.03,107 164.34,107 164.34,107.63 171.32,107.63 171.32,105.09 192.28,105.09 v192.28,102.55
!AC7
  Top 0.406: H.B1 76.71,201.77 76.71,184.47 91.95,184.47 91.95,175.74 98.93,175.74 98.93,171.13 111.63,171.13 111.63,145.41 112.9,145.41 112.9,115.89 108.78,115.89 108.78,110.33 107.51,110.33 E38.6
!B_IO_PAUSE
  ECO2 0.406: E34.1 128.46,162.4 126.56,162.4 126.56,173.83 145.92,173.83 145.92,153.83 161.48,153.83 161.48,151.61 231.01,151.61 231.01,38.73 245.3,38.73 E1.11
!BDATA10  (via drill 0.81 pad 0.41)
  Top 0.406: v42.73,191.77 42.73,186.85 53.21,186.85 53.21,185.42 62.42,185.42 62.42,179.55 55.12,179.55 55.12,168.91 53.21,168.91 v53.21,166.37
  Bottom 0.406: J.P2 42.73,200.5 v42.73,191.77 | v53.21,166.37 53.21,168.59 58.61,168.59 58.61,166.53 61.47,166.53 61.47,163.83 65.91,163.83 E41.2
!BDATA11  (via drill 0.81)
  Top 0.406: J.H1 23.37,195.9 23.37,190.02 21.15,190.02 21.15,165.26 27.81,165.26 27.81,154.31 33.84,154.31 33.84,143.51 39.24,143.51 39.24,129.22 39.88,129.22 39.88,116.84 37.97,116.84 37.97,109.06 39.24,109.06 39.24,104.14 41.78,104.14 41.78,96.68 48.13,96.68 48.13,92.08 49.4,92.08 v49.4,88.9 | E45.2 61.15,82.39 62.42,82.39 62.42,71.91 61.15,71.91 E44.2
  Bottom 0.406: v49.4,88.9 52.26,88.9 52.26,91.76 61.15,91.76 E45.2
!BRK_DIR  (via drill 0.81 pad 0.41)
  Top 0.406: v174.5,136.84 174.5,139.86 172.91,139.86 172.91,167.64 179.58,167.64 179.58,176.05 187.2,176.05 v187.2,181.61
  Bottom 0.406: H.P2 111.95,200.82 111.95,185.1 141.8,185.1 141.8,188.44 187.2,188.44 v187.2,181.61 | E20.5 189.1,133.99 175.77,133.99 175.77,136.84 v174.5,136.84
!BTP3  (via drill 0.81 pad 0.41)
  Top 0.406: J.U1 55.43,195.58 55.43,193.99 v56.07,193.99 | E21.4 184.02,152.24 185.29,152.24 185.29,133.35 182.75,133.35 E19.12 E19.3
  ECO2 0.406: v56.07,193.99 56.07,184.15 174.5,184.15 174.5,154.31 184.02,154.31 E21.4
!BTP3_OK
  Top 0.406: E21.5 E20.11
!C0
  Top 0.406: OMNIBUS.CE1 115.12,21.75 111,21.75 111,27.94 120.2,27.94 E29.4
!C1
  Top 0.406: OMNIBUS.CH1 108.46,9.05 108.46,16.99 104.97,16.99 104.97,22.07 109.41,22.07 109.41,29.21 117.67,29.21 E29.3
!CLR_ALL  (via drill 0.81 pad 0.41)
  Top 0.406: E14.3 210.69,165.89 219.58,165.89 219.58,138.27 217.04,138.27 217.04,130.49 223.39,130.49 E12.6 | v142.11,127.95 142.11,126.52 141.16,126.52 141.16,120.97 136.72,120.97 E33.6
  Bottom 0.406: J.U2 54.48,201.77 54.48,187.48 35.75,187.48 35.75,186.37 11.62,186.37 11.62,154.62 4.32,154.62 4.32,131.44 6.86,131.44 6.86,116.2 12.89,116.2 12.89,111.92 25.27,111.92 25.27,115.89 35.75,115.89 35.75,119.7 44.96,119.7 44.96,125.89 62.74,125.89 62.74,131.13 73.22,131.13 73.22,133.35 79.25,133.35 79.25,140.49 96.71,140.49 96.71,143.51 102.43,143.51 102.43,140.81 107.51,140.81 107.51,141.6 113.22,141.6 113.22,137.32 124.02,137.32 124.02,132.4 129.73,132.4 129.73,131.76 142.11,131.76 | 142.11,131.76 v142.11,127.95 | 142.11,131.76 158.62,131.76 158.62,133.67 166.88,133.67 166.88,132.08 171.96,132.08 171.96,129.86 180.53,129.86 180.53,127.95 184.02,127.95 184.02,125.89 199.58,125.89 199.58,121.76 208.47,121.76 208.47,123.98 220.22,123.98 220.22,124.94 223.39,124.94 E12.6
!CLR_DRIVE_CMD  (via drill 0.81, 0.81 pad 0.41)
  Top 0.406: v10.35,187.96 10.35,186.06 10.99,186.06 10.99,157.8 13.52,157.8 13.52,140.97 14.79,140.97 E54.4 14.79,130.49 11.3,130.49 11.3,116.52 14.16,116.52 14.16,108.43 10.99,108.43 10.99,88.42 11.62,88.42 11.62,75.56 12.57,75.56 v12.57,72.39 | E44.6 71.31,68.9 v78.93,68.9
  Bottom 0.406: J.C2 10.35,199.71 v10.35,187.96 | v12.57,72.39 12.57,70.33 31.31,70.33 31.31,69.37 41.78,69.37 41.78,68.26 77.03,68.26 77.03,68.9 v78.93,68.9
!CLR_STATUS  (via drill 0.81 pad 0.41)
  Top 0.406: E50.16 11.94,62.55 13.84,62.55 13.84,68.26 18.29,68.26 18.29,91.76 14.79,91.76 E52.1 | v77.98,129.54 75.76,129.54 75.76,155.57 57.34,155.57 57.34,159.07 48.45,159.07 48.45,166.85 49.09,166.85 E48.6 | E39.1 92.27,128.59 102.43,128.59 E39.10
  Bottom 0.406: E52.1 14.79,102.87 12.89,102.87 12.89,109.38 30.67,109.38 30.67,112.24 39.24,112.24 39.24,116.84 48.13,116.84 48.13,122.71 65.91,122.71 65.91,128.27 76.07,128.27 76.07,129.54 v77.98,129.54 82.11,129.54 82.11,137.64 97.03,137.64 97.03,136.68 102.43,136.68 E39.10
!CLR_SYN  (via drill 0.81 pad 0.41)
  Top 0.406: E52.9 v27.5,112.71 | v138.62,128.91 136.72,128.91 136.72,137.64 132.27,137.64 132.27,156.84 139.89,156.84 139.89,169.23 141.16,169.23 E34.9
  Bottom 0.406: v27.5,112.71 27.5,114.62 37.02,114.62 37.02,118.75 46.23,118.75 46.23,124.62 63.69,124.62 63.69,130.18 74.17,130.18 74.17,132.08 80.2,132.08 80.2,139.54 97.98,139.54 97.98,142.24 101.47,142.24 101.47,139.86 108.46,139.86 108.46,140.49 112.27,140.49 112.27,136.37 123.06,136.37 123.06,131.44 126.24,131.44 126.24,128.91 v138.62,128.91
!DATA0
  Top 0.406: OMNIBUS.AR1 219.58,9.05 219.58,23.18 205.3,23.18 205.3,40.01 219.58,40.01 219.58,49.53 215.77,49.53 E8.3
!DATA1
  Top 0.406: OMNIBUS.AS1 217.04,8.73 217.04,22.07 204.34,22.07 204.34,40.96 218.31,40.96 E8.4
!DATA2
  Top 0.406: OMNIBUS.AU1 210.06,9.84 210.06,21.11 203.39,21.11 203.39,41.91 214.5,41.91 214.5,50.48 220.85,50.48 E8.12
!DATA3
  Top 0.406: OMNIBUS.AV1 207.52,7.78 207.52,19.84 202.44,19.84 202.44,42.7 208.47,42.7 208.47,53.02 218.31,53.02 E8.13
!DATA4
  Top 0.406: OMNIBUS.BR1 150.05,16.99 152.59,16.99 152.59,21.75 156.72,21.75 156.72,30.32 152.91,30.32 E22.3
!DATA5
  Top 0.406: OMNIBUS.BS1 146.88,18.57 151.32,18.57 151.32,22.7 155.45,22.7 E22.4
!DATA6
  Top 0.406: OMNIBUS.BU1 140.84,10.48 140.84,20.8 150.37,20.8 150.37,25.72 151.64,25.72 151.64,31.27 157.99,31.27 E22.12
!DATA7
  Top 0.406: OMNIBUS.BV1 137.67,12.38 137.67,22.07 149.1,22.07 149.1,33.81 155.45,33.81 E22.13
  Bottom 0.406: E35.12 91,40.01 105.92,40.01 105.92,41.59 110.36,41.59 110.36,42.7 139.89,42.7 139.89,38.42 155.45,38.42 E22.13
!DATA8
  Top 0.406: OMNIBUS.DR1 16.7,22.7 20.19,22.7 E49.3
!DATA9
  Top 0.406: OMNIBUS.DS1 13.52,23.81 18.92,23.81 18.92,28.57 22.73,28.57 E49.4
!DATA10
  Top 0.406: OMNIBUS.DU1 7.49,7.46 7.49,30 25.27,30 E49.12
!DATA11
  Top 0.406: OMNIBUS.DV1 4,31.59 22.73,31.59 E49.13
!DATA_RQST_LATE  (via drill 0.81 pad 0.41)
  Top 0.406: v74.8,110.49 73.22,110.49 73.22,144.15 67.18,144.15 67.18,145.1 62.74,145.1 E47.9
  Bottom 0.406: E39.6 104.97,122.08 93.54,122.08 93.54,119.06 76.71,119.06 76.71,110.49 v74.8,110.49
!DATA_STATE  (via drill 0.81 pad 0.41)
  Top 0.406: v35.75,189.55 35.75,182.56 40.2,182.56 40.2,176.37 42.73,176.37 42.73,166.21 45.28,166.21 45.28,156.21 51.94,156.21 51.94,151.29 53.53,151.29 53.53,147.64 52.58,147.64 E47.13
  Bottom 0.406: J.M2 35.75,200.82 v35.75,189.55
!DB_CONT1  (via drill 0.81 pad 0.41)
  Top 0.406: H.V1 127.83,201.77 127.83,189.71 141.48,189.71 141.48,194.31 202.44,194.31 202.44,163.67 205.61,163.67 205.61,155.89 208.15,155.89 v208.15,152.72 | E12.13 213.23,136.05 214.82,136.05 214.82,144.46 v217.68,144.46
  Bottom 0.406: E13.6 225.93,144.46 v217.68,144.46 214.82,144.46 214.82,147.8 209.74,147.8 209.74,152.88 v208.15,152.72
!DB_CONT2  (via drill 0.81 pad 0.41)
  Top 0.406: v159.89,179.71 157.03,179.86 157.03,170.5 155.77,170.5 E28.3 | E13.9 225.93,160.5 227.2,160.5 227.2,152.24 225.93,152.24 E12.8
  Bottom 0.406: E13.9 225.93,164.94 198.94,164.94 198.94,171.77 175.13,171.77 175.13,176.37 172.28,176.37 172.28,178.91 161.8,178.91 161.8,179.86 v159.89,179.71
!DB_CONT3
  Top 0.406: E13.11 220.85,166.85 211.96,166.85 211.96,177.96 210.69,177.96 E14.14
!DB_CONT4  (via drill 0.81 pad 0.41)
  Top 0.406: E39.2 94.81,118.75 86.55,118.75 86.55,101.44 89.09,101.44 89.09,77.47 91.31,77.47 v91.31,71.44
  ECO1 0.406: R15.2 149.1,41.91 149.1,66.04 219.58,66.04 E9.6
  Bottom 0.406: R15.2 142.11,41.91 142.11,44.77 C56.1 104.01,44.77 104.01,42.23 89.09,42.23 89.09,41.59 78.3,41.59 78.3,39.69 48.13,39.69 48.13,41.91 37.02,41.91 37.02,39.37 32.89,39.37 32.89,38.73 22.73,38.73 | E9.6 219.58,66.99 190.37,66.99 | 190.37,66.99 E17.6 | 190.37,66.99 167.83,66.99 167.83,70.64 164.34,70.64 | E24.6 164.34,70.64 | 164.34,70.64 140.21,70.64 140.21,75.56 130.05,75.56 130.05,73.5 96.39,73.5 96.39,71.44 v91.31,71.44
!DEVICE_RK  (via drill 0.81 pad 0.41)
  Top 0.406: E37.2 v96.71,74.93
  Bottom 0.406: E31.4 128.78,74.45 98.62,74.45 98.62,74.93 v96.71,74.93
!DONE_FLAG  (via drill 0.81 pad 0.41)
  Top 0.406: E54.2 9.71,133.03 9.08,133.03 9.08,113.82 v10.35,113.67
  Bottom 0.406: E39.9 104.97,137.95 97.98,137.95 97.98,138.59 81.15,138.59 81.15,131.13 75.12,131.13 75.12,129.22 64.96,129.22 64.96,123.67 47.18,123.67 47.18,117.79 37.97,117.79 37.97,113.51 29.4,113.51 29.4,110.65 10.35,110.65 v10.35,113.67
!DSK_CAPACITY_EX  (via drill 0.81 pad 0.41)
  Top 0.406: J.K1 29.4,195.9 29.4,190.02 26.86,190.02 26.86,168.91 32.26,168.91 32.26,158.43 37.65,158.43 37.65,147.48 43.05,147.48 43.05,133.35 44.64,133.35 44.64,114.46 44.01,114.46 44.01,98.58 51.31,98.58 v51.31,97.16 | R1.2 15.43,88.42 15.43,83.03 R2.1
  Bottom 0.406: E45.12 63.69,103.82 56.07,103.82 56.07,99.22 51.31,99.22 v51.31,97.16 49.09,97 49.09,96.04 34.8,96.04 34.8,92.71 29.08,92.71 29.08,91.12 13.52,91.12 R1.2
!DSK_FILE_RDY
  Top 0.406: H.E1 86.87,201.77 86.87,189.71 98.3,189.71 98.3,180.97 111.63,180.97 111.63,177.64 145.92,177.64 145.92,150.65 144.65,150.65 144.65,134.46 156.08,134.46 156.08,123.67 149.1,123.67 149.1,120.33 146.24,120.33 146.24,103.82 144.65,103.82 144.65,88.11 147.19,88.11 147.19,68.26 147.83,68.26 147.83,64.14 157.35,64.14 157.35,40.32 151.64,40.32 151.64,34.77 147.83,34.77 E22.1
!DSK_WRT_STATUS  (via drill 0.81, 0.81 pad 0.41)
  Top 0.406: v15.11,191.77 13.52,191.77 13.52,160.34 18.61,160.34 18.61,129.22 21.78,129.22 21.78,124.62 24.32,124.62 24.32,115.25 21.15,115.25 21.15,103.19 24.96,103.19 24.96,100.81 26.23,100.81 26.23,94.93 21.78,94.93 21.78,75.56 v23.69,75.56 25.27,75.56 25.27,77.47 30.35,77.47 30.35,82.07 34.16,82.07 E51.12
  Bottom 0.406: J.D2 13.84,201.45 13.84,194.31 15.11,194.31 v15.11,191.77 | v23.69,75.56 17.97,75.56 17.97,78.11 R4.2 R3.1
!ENAB_RK_DATA  (via drill 0.81 pad 0.41)
  Top 0.406: v36.7,65.72 36.7,58.9 32.26,58.9 32.26,49.05 30.35,49.05 30.35,36.51 32.89,36.51 E49.9 | v133.86,72.39 E31.6 | v175.13,61.59 175.13,46.51 170.05,46.51 170.05,38.73 165.61,38.73 E22.9
  Bottom 0.406: v36.7,65.72 38.29,65.72 38.29,64.77 87.5,64.77 87.5,68.74 98.3,68.74 98.3,71.6 131.95,71.6 131.95,72.55 v133.86,72.39 136.4,72.55 136.4,68.58 165.93,68.58 165.93,64.77 175.13,64.77 | 175.13,64.77 v175.13,61.59 | 175.13,64.77 222.12,64.77 222.12,58.9 228.47,58.9 E8.9
!END_STATE  (via drill 0.81 pad 0.41)
  Top 0.406: v26.86,191.45 25.59,191.45 25.59,167.96 30.99,167.96 30.99,157.48 36.7,157.48 36.7,146.37 42.1,146.37 42.1,132.4 43.69,132.4 43.69,115.57 43.05,115.57 43.05,97.63 49.09,97.63 49.09,94.3 51.31,94.3 51.31,81.92 46.23,81.92 v46.23,70.8
  Bottom 0.406: J.J2 26.54,200.18 26.54,193.68 26.86,193.68 v26.86,191.45 | v46.23,70.8 44.01,70.64 44.01,71.28 41.78,71.28 E51.6
!ERROR_CLR
  Top 0.406: J.D1 13.52,193.68 12.57,193.68 12.57,159.07 16.07,159.07 16.07,129.22 15.43,129.22 E53.13
!ERROR_FL  (via drill 0.81 pad 0.41)
  Top 0.406: v21.78,134.62 21.78,130.49 23.05,130.49 E53.10
  Bottom 0.406: E54.1 7.18,134.46 v21.78,134.62
!HI_RD_CLK  (via drill 0.81 pad 0.41)
  Top 0.406: E11.12 215.77,124.94 209.42,124.94 209.42,139.22 210.06,139.22 v210.06,140.65 | E27.10 157.35,149.38 157.99,149.38 v157.99,151.45
  Bottom 0.406: v210.06,140.65 204.66,140.81 204.66,148.11 169.1,148.11 169.1,150.65 159.89,150.65 159.89,151.61 v157.99,151.45
!IDLE  (via drill 0.81 pad 0.41)
  Top 0.406: J.N1 39.24,201.14 39.24,184.78 46.54,184.78 46.54,182.25 | 46.54,182.25 v58.93,182.25 | v193.55,167.32 193.55,164.94 195.13,164.94 195.13,147 196.41,147 196.41,112.24 190.37,112.24 E19.6 | E48.10 46.54,182.25
  Bottom 0.406: v58.93,182.25 58.93,184.47 61.47,184.47 61.47,183.83 82.11,183.83 82.11,180.02 103.7,180.02 103.7,176.69 118.3,176.69 118.3,177.96 157.03,177.96 157.03,177.01 170.37,177.01 170.37,174.47 172.91,174.47 172.91,169.23 190.37,169.23 190.37,167.32 v193.55,167.32
!INT_RQST
  Top 0.406: E36.4 113.86,54.61 104.33,54.61 104.33,26.35 88.45,26.35 88.45,16.99 89.73,16.99 OMNIBUS.CP1
!INTERNAL_IO
  Top 0.406: OMNIBUS.CL1 99.25,16.67 95.44,16.67 95.44,25.4 105.6,25.4 105.6,53.34 120.2,53.34 120.2,62.55 116.4,62.55 E36.10
!IO_PAUSE  (via drill 0.81 pad 0.41)
  Top 0.406: OMNIBUS.CD1 118.3,22.7 112.27,22.7 112.27,26.35 121.48,26.35 v121.48,46.35 | E35.10 v96.08,44.13
  Bottom 0.406: v96.08,44.13 96.08,43.02 103.06,43.02 103.06,46.51 111,46.51 111,45.88 119.25,45.88 119.25,46.35 v121.48,46.35
!LD_DB_AC  (via drill 0.81 pad 0.41)
  Top 0.406: v78.61,179.07 74.8,179.07 74.8,169.86 83.38,169.86 83.38,164.94 86.23,164.94 86.23,161.13 100.52,161.13 E40.10 100.52,150.65 99.25,150.65 v99.25,140.65
  Bottom 0.406: E33.13 126.56,127.16 124.02,127.16 124.02,129.22 121.16,129.22 121.16,134.3 110.36,134.3 110.36,135.73 107.82,135.73 107.82,138.91 99.25,138.91 v99.25,140.65 | E54.11 14.79,183.83 38.29,183.83 38.29,185.74 57.34,185.74 57.34,180.97 61.15,180.97 61.15,182.56 78.61,182.56 v78.61,179.07 102.43,179.23 102.43,175.74 119.25,175.74 119.25,177.01 156.08,177.01 156.08,176.05 169.42,176.05 169.42,173.51 171.96,173.51 171.96,168.28 189.1,168.28 E21.9
!LO_MAIN_SHFT
  Top 0.406: H.P1 112.27,201.77 112.27,190.34 121.79,190.34 121.79,185.1 148.78,185.1 148.78,188.44 187.83,188.44 187.83,184.15 189.42,184.15 189.42,175.1 180.85,175.1 180.85,166.53 173.86,166.53 173.86,141.29 178.94,141.29 E20.1
!MAIN  (via drill 0.81)
  Top 0.406: J.E1 17.02,201.77 17.02,190.02 14.79,190.02 14.79,161.13 23.37,161.13 23.37,150.65 30.04,150.65 29.72,139.54 34.8,139.54 v34.8,123.19 | v85.6,144.46 90.36,144.46 E40.1
  Bottom 0.406: v34.8,123.19 41.78,123.03 41.78,134.3 50.04,134.3 | 50.04,134.3 70.04,134.3 70.04,136.37 76.07,136.37 76.07,143.83 83.38,143.83 83.38,144.46 v85.6,144.46 | E47.1 50.04,134.3
!MAK
  Top 0.406: H.J1 96.39,201.77 96.39,192.88 102.43,192.88 102.43,184.47 115.12,184.47 115.12,180.34 155.77,180.34 E28.12
!MD0
  Top 0.406: E2.7 256.1,43.02 256.1,23.5 236.09,23.81 236.09,8.41 OMNIBUS.AK1
!MD1
  Top 0.406: E2.9 250.38,49.05 251.65,49.05 251.65,40.64 254.82,40.64 254.82,25.08 232.28,25.08 232.28,8.73 OMNIBUS.AL1
!MD2
  Top 0.406: OMNIBUS.AM1 229.74,8.73 229.74,30.96 246.57,30.96 246.57,39.37 245.3,39.37 E2.4
!MD3
  Top 0.406: OMNIBUS.AP1 222.76,9.05 222.76,23.18 228.47,23.18 228.47,32.86 242.76,32.86 E1.12 242.76,39.37 244.03,39.37 244.03,48.74 242.76,48.74 E2.12
!MD4  (via drill 0.81 pad 0.41)
  Top 0.406: v193.55,44.77 193.55,30 E15.7 191.01,24.13 186.56,24.13 186.56,20.16 176.4,20.16 176.4,22.38 165.93,22.38 OMNIBUS.BK1
  Bottom 0.406: E1.10 247.84,39.05 231.97,39.05 231.97,41.91 204.03,41.91 204.03,43.66 196.72,43.66 196.72,44.77 v193.55,44.77
!MD5  (via drill 0.81 pad 0.41)
  Top 0.406: OMNIBUS.BL1 163.07,8.41 163.07,23.18 185.61,23.18 185.61,25.08 189.74,25.08 189.74,36.04 188.47,36.04 E15.9 v188.47,44.77
  Bottom 0.406: E1.9 250.38,40.32 233.24,40.32 233.24,42.7 204.98,42.7 204.98,44.61 197.99,44.61 197.99,46.51 188.47,46.51 v188.47,44.77
!MD6
  Top 0.406: OMNIBUS.BM1 159.89,10.48 159.89,24.45 180.53,24.45 180.53,26.99 183.39,26.99 E15.4
  Bottom 0.406: W2W5.1 201.17,31.27 201.17,28.57 183.39,28.57 E15.4
!MD7
  Top 0.406: OMNIBUS.BP1 152.91,9.05 152.91,15.88 153.54,15.88 153.54,20.8 158.31,20.8 158.31,25.4 178.62,25.4 178.62,28.57 182.12,28.57 182.12,36.04 180.85,36.04 E15.12
  Bottom 0.406: E15.12 180.85,39.69 199.9,39.69 199.9,36.2 W1W4.3
!MD8
  Top 0.406: E42.7 77.03,21.11 32.58,21.11 OMNIBUS.DK1
  Bottom 0.406: W3W6.3 163.07,26.35 163.07,23.5 142.43,23.5 142.43,28.57 131,28.57 131,30 120.52,30 120.52,30.64 103.7,30.64 103.7,28.42 84.96,28.42 84.96,28.89 E42.7
!MD9
  Top 0.406: OMNIBUS.DL1 29.4,22.38 75.76,22.38 75.76,34.77 74.48,34.77 E42.9
!MD10
  Top 0.406: E42.4 69.41,24.77 55.12,24.77 55.12,27.94 50.36,27.94 50.36,23.18 26.23,23.18 OMNIBUS.DM1
!MD11
  Top 0.406: OMNIBUS.DP1 19.88,21.43 24.64,21.43 24.64,24.45 48.77,24.45 48.77,29.21 56.07,29.21 56.07,26.35 68.14,26.35 68.14,34.45 66.87,34.45 E42.12
!MD_RD_BUFF  (via drill 0.81 pad 0.41)
  Top 0.406: E2.11 E2.10 E2.5 E2.6 | v185.93,44.77 E15.10 185.93,34.45 188.47,34.45 E15.6 | E19.11 185.29,130.49 191.64,130.49 E20.6 | R9.1 140.84,145.1 140.84,133.35 154.18,133.35 v154.18,126.05 151.96,126.21 151.96,124.62 148.15,124.62 148.15,121.76 144.97,121.76 144.97,105.41 142.43,105.41 142.43,66.36 145.92,66.36 145.92,62.23 152.91,62.23 152.91,49.05 153.86,49.05 v153.86,44.13
  Bottom 0.406: E27.3 152.27,134.78 136.4,134.78 136.4,136.68 131.32,136.68 131.32,142.24 | 131.32,142.24 131.32,145.1 R9.1 | E2.5 247.84,41.59 234.5,41.59 234.5,43.66 205.93,43.66 205.93,45.56 199.26,45.56 199.26,47.78 185.93,47.78 v185.93,44.77 171.96,44.77 171.96,44.13 v153.86,44.13 | 131.32,142.24 116.4,142.24 116.4,144.78 107.51,144.78 107.51,145.73 87.19,145.73 87.19,146.69 82.11,146.69 82.11,145.1 75.12,145.1 75.12,137.64 69.09,137.64 69.09,135.41 52.58,135.41 E47.2 | E19.11 185.29,119.38 173.55,119.38 173.55,121.13 168.78,121.13 168.78,123.03 163.07,123.03 163.07,124.3 157.35,124.3 157.35,126.21 v154.18,126.05
!MD_RK
  Top 0.406: R11.1 52.26,23.18 71.95,23.18 E42.5 E42.10 E42.11
  Bottom 0.406: R11.1 52.26,21.43 6.22,21.43 6.22,65.09 9.4,65.09 9.4,70.64 6.86,70.64 6.86,74.14 15.11,74.14 15.11,71.6 27.18,71.6 27.18,73.18 E51.1
!NOT_EQUAL  (via drill 0.81)
  Top 0.406: E51.8 44.32,82.71 47.18,82.71 47.18,95.41 40.83,95.41 40.83,103.19 37.97,103.19 37.97,108.11 37.02,108.11 37.02,118.11 38.93,118.11 38.93,128.27 38.29,128.27 38.29,142.56 32.89,142.56 32.89,153.51 26.86,153.51 26.86,163.99 19.88,163.99 20.19,191.45 v21.46,191.45
  Bottom 0.406: v21.46,191.45 21.46,194.31 19.88,194.31 J.F2 | E51.5 39.24,75.88 27.18,75.88 27.18,82.71 44.32,82.71 E51.8
!RD_BRK  (via drill 0.81 pad 0.41)
  Top 0.406: v177.04,182.88 163.38,182.88 E28.9
  Bottom 0.406: H.L2 102.11,199.07 102.11,181.93 144.97,181.93 144.97,185.42 177.04,185.42 v177.04,182.88
!RDY_S/R/W  (via drill 0.81 pad 0.41)
  Top 0.406: H.U1 124.65,201.77 124.65,194.63 126.56,194.63 126.56,188.75 143.38,188.75 143.38,193.2 198.63,193.2 198.63,188.44 200.53,188.44 200.53,164.94 198.63,164.94 198.63,149.7 199.58,149.7 199.58,126.84 200.22,126.84 200.22,104.78 203.07,104.78 203.07,97.63 197.36,97.63 197.36,84.93 197.99,84.93 v197.99,81.92 | E8.6 223.39,50.48 222.12,50.48 222.12,58.26 236.73,58.26 236.73,70.48 v238.31,70.48
  Bottom 0.406: v197.99,81.92 197.99,80.01 223.71,80.01 223.71,75.56 232.6,75.56 232.6,70.48 v238.31,70.48
!RK_DATA0
  Bottom 0.406: E8.2 213.23,46.83 209.1,46.83 209.1,49.05 202.75,49.05 202.75,51.12 196.09,51.12 E16.6
!RK_DATA1
  Bottom 0.406: E8.5 220.85,45.88 208.15,45.88 208.15,47.78 201.8,47.78 201.8,50.16 191.01,50.16 E16.4
!RK_DATA2
  Bottom 0.406: E16.10 193.55,62.55 217.04,62.55 217.04,57.94 223.39,57.94 E8.11
!RK_DATA3
  Bottom 0.406: E16.8 215.77,60.8 E8.14
!RK_DATA4
  Top 0.406: E22.2 150.37,32.54 156.72,32.54 156.72,37.78 164.66,37.78 164.66,39.69 168.78,39.69 168.78,47.47 174.18,47.47 174.18,55.72 171.32,55.72 E23.8
!RK_DATA5
  Top 0.406: E22.5 157.99,30.32 168.78,30.32 168.78,36.51 171.96,36.51 171.96,44.77 177.35,44.77 177.35,50.8 187.2,50.8 187.2,57.94 188.47,57.94 E16.12
!RK_DATA6
  Top 0.406: E16.2 185.93,51.75 176.09,51.75 176.09,45.56 171,45.56 171,37.78 167.83,37.78 167.83,34.77 160.53,34.77 E22.11
!RK_DATA7
  Top 0.406: E22.14 152.91,39.05 163.38,39.05 163.38,40.96 167.83,40.96 167.83,48.42 173.23,48.42 173.23,54.93 166.24,54.93 E23.10
!RK_DATA8
  Bottom 0.406: E49.2 17.65,28.89 13.21,28.89 13.21,36.04 16.38,36.04 16.38,42.23 23.37,42.23 23.37,46.83 29.72,46.83 29.72,45.88 51.94,45.88 51.94,43.66 74.17,43.66 74.17,45.56 84.96,45.56 84.96,49.21 99.25,49.21 99.25,50.8 112.27,50.8 112.27,52.07 127.19,52.07 127.19,49.85 147.19,49.85 147.19,48.9 158.62,48.9 E23.2
!RK_DATA9  (via drill 0.81 pad 0.41)
  Top 0.406: v31.62,40.96 31.62,37.47 36.07,37.47 36.07,30.96 26.54,30.96 26.54,28.57 25.27,28.57 E49.5
  Bottom 0.406: E23.6 168.78,46.51 145.29,46.51 145.29,47.78 125.29,47.78 125.29,49.53 114.81,49.53 114.81,49.05 101.16,49.05 101.16,47.15 87.19,47.15 87.19,43.66 76.07,43.66 76.07,41.91 70.36,41.91 50.67,41.59 50.04,41.59 50.04,43.97 31.62,43.97 v31.62,40.96
!RK_DATA10  (via drill 0.81 pad 0.41)
  Top 0.406: E49.11 27.81,36.51 26.54,36.51 v26.54,40.96
  Bottom 0.406: E23.4 163.7,47.78 146.24,47.78 146.24,48.74 126.24,48.74 126.24,50.8 113.54,50.8 113.54,49.85 100.2,49.85 100.2,48.42 86.23,48.42 86.23,44.61 75.12,44.61 75.12,42.7 50.99,42.7 50.99,44.93 29.4,44.93 29.4,40.96 v26.54,40.96
!RK_DATA11  (via drill 0.81 pad 0.41)
  Top 0.406: E49.14 20.19,36.83 22.1,36.83 22.1,49.53 20.83,49.53 20.83,53.98 18.29,53.98 18.29,65.09 21.46,65.09 21.46,66.67 v22.73,66.67
  Bottom 0.406: E23.12 161.16,63.82 135.76,63.82 135.76,64.45 131.63,64.45 131.63,69.06 100.52,69.06 100.52,66.67 91.95,66.67 91.95,63.82 34.48,63.82 34.48,65.09 22.73,65.09 v22.73,66.67
!SECTOR_SEEK
  Top 0.406: J.F1 19.88,193.68 18.61,193.68 18.61,184.78 18.29,163.04 25.59,163.04 25.59,152.56 31.94,152.56 31.94,141.6 37.34,141.6 37.34,127.48 37.97,127.48 37.97,119.38 36.07,119.38 36.07,107 37.02,107 37.02,102.23 39.88,102.23 39.88,94.3 46.23,94.3 46.23,83.66 41.78,83.66 E51.9
!SET_IDLE_PL  (via drill 0.81 pad 0.41)
  Top 0.406: J.J1 26.54,197.17 26.54,193.68 24.64,193.68 24.64,167 30.04,167 30.04,156.21 35.75,156.21 35.75,145.41 41.15,145.41 41.15,131.44 42.1,131.44 42.1,114.46 40.51,114.46 v40.51,112.71 | E46.3 58.29,114.46 55.75,114.46 E46.13
  Bottom 0.406: v40.51,112.71 40.51,115.89 49.09,115.89 49.09,121.76 55.75,121.76 E46.13
!SHFT_WRT_BUFF  (via drill 0.81 pad 0.41)
  Top 0.406: v189.1,186.69 189.1,185.42 190.37,185.42 190.37,174.15 181.8,174.15 181.8,165.58 174.81,165.58 174.81,142.56 181.48,142.56 E20.2
  Bottom 0.406: H.R2 115.44,196.85 115.44,186.06 140.84,186.06 140.84,188.75 141.8,189.71 189.1,189.71 v189.1,186.69
!SKIP
  Top 0.406: OMNIBUS.CS1 83.38,36.2 89.73,36.2 89.73,40.01 94.81,40.01 94.81,46.04 103.06,46.04 103.06,56.52 E36.1
!TEST_CLK
  Top 0.406: E7.2 238,179.23 245.62,179.23 E7.12
!TS3  (via drill 0.81)
  ECO1 0.406: E35.9 98.62,41.27 103.06,41.27 103.06,26.35 95.44,26.35 95.44,15.56 v96.08,15.56
  Bottom 0.406: OMNIBUS.CM2 v96.08,15.56
!WRT_BRK
  Top 0.406: H.H1 93.22,201.77 93.22,191.61 101.16,191.61 101.16,183.2 114.17,183.2 114.17,179.55 148.46,179.55 148.46,167.32 153.22,167.32 E28.2
!WRT_BUFF_SHFT  (via drill 0.81 pad 0.41)
  Top 0.406: v195.45,77.15 195.45,79.06 190.37,79.06 E17.9
  Bottom 0.406: E31.8 147.19,84.93 147.19,83.66 156.08,83.66 156.08,82.39 164.34,82.39 | 164.34,82.39 172.59,82.39 172.59,80.64 190.37,80.64 E17.9 | E24.9 164.34,82.39 | E9.9 219.58,77.79 198.94,77.79 198.94,77.15 v195.45,77.15
!WRT_CMD  (via drill 0.81)
  Top 0.406: v17.02,187.96 17.02,162.08 24.64,162.08 24.64,151.61 30.99,151.61 30.99,140.81 36.39,140.81 36.39,126.52 37.02,126.52 37.02,120.65 34.8,120.65 34.8,105.41 35.43,105.41 35.43,101.12 | E51.11 36.7,86.2 44.32,86.2 44.32,92.39 35.43,92.39 35.43,101.12 | 35.43,101.12 v37.97,100.97 | E11.2 E11.13
  Bottom 0.406: J.E2 17.02,201.45 v17.02,187.96 | v37.97,100.97 53.85,101.12 53.85,106.05 67.5,106.05 67.5,104.14 80.84,104.14 80.84,115.25 115.76,115.25 115.76,112.55 140.84,112.55 140.84,110.01 146.88,110.01 146.88,107.31 156.08,107.31 156.08,108.11 163.07,108.11 163.07,108.74 172.59,108.74 172.59,106.05 193.55,106.05 193.55,104.78 213.23,104.78 E11.2
!WT_BUFF_DATA  (via drill 0.81 pad 0.41)
  Top 0.406: v81.79,191.13 81.79,187.8 96.08,187.8 96.08,178.91 103.38,178.91 103.38,173.83 124.65,173.83 | 124.65,173.83 v124.65,171.77 | 124.65,173.83 134.81,173.83 134.81,159.38 130.05,159.38 130.05,127.64 129.09,127.64 E33.12
  Bottom 0.406: v124.65,171.77 124.65,175.1 154.18,175.1 154.18,173.83 167.51,173.83 167.51,171.77 169.74,171.77 169.74,166.21 178.94,166.21 E21.13 | H.D2 83.38,198.12 83.38,191.13 v81.79,191.13
+3V  (via drill 0.81, 0.81 pad 0.41)
  Top 0.406: E43.4 66.23,54.29 71.31,54.29 E43.11 | E38.4 102.43,106.68 104.97,106.68 E38.10 104.97,120.02 v107.51,120.02 | E4.1 235.46,78.74 236.09,78.74 v236.09,75.25 | v203.71,169.23 203.71,166.21 206.56,166.21 206.56,157.16 210.69,157.16 210.69,150.34 204.98,150.34 204.98,127.16 203.39,127.16 203.39,121.13 209.1,121.13 209.1,104.78 216.41,104.78 216.41,89.22 204.98,89.22 E10.1 | E18.1 v176.4,83.19 | E7.3 240.54,177.64 248.16,177.64 E7.11 | E50.1 11.94,55.56 10.35,55.56 10.35,63.5 12.89,63.5 12.89,69.06 17.34,69.06 17.34,90.49 13.52,90.49 13.52,99.85 22.42,99.85 E52.4 | v148.46,113.67 148.46,94.61 147.19,94.61 E25.1
  Bottom 0.406: E14.2 208.15,169.23 | 208.15,169.23 208.15,168.28 240.54,168.28 E7.3 | 208.15,169.23 v203.71,169.23 | E50.1 11.94,50.8 29.72,50.8 E50.8 39.56,52.39 39.56,50.48 56.71,50.48 56.71,48.42 66.23,48.42 E43.4 | v236.09,75.25 236.09,77.79 225.93,77.79 225.93,82.07 204.98,82.07 E10.1 201.8,86.84 201.8,85.25 192.28,85.25 192.28,83.03 v176.4,83.19 176.4,86.52 161.8,86.52 161.8,85.88 153.54,85.88 153.54,88.9 147.19,88.9 E25.1 | 129.09,115.89 119.25,115.89 119.25,121.44 110.36,121.44 110.36,120.02 v107.51,120.02 103.38,120.02 103.38,121.13 94.81,121.13 94.81,118.11 77.66,118.11 77.66,108.74 33.84,108.74 33.84,99.54 31.62,99.54 31.62,96.36 22.42,96.36 E52.4 22.42,99.85 17.34,99.85 E52.13 | E33.3 129.09,115.89 | 129.09,115.89 143.7,115.89 143.7,113.82 v148.46,113.67
AC7  (via drill 0.81 pad 0.41)
  Top 0.406: E54.12 12.26,144.15 8.44,144.15 8.44,134.3 8.13,134.3 8.13,99.85 8.44,99.85 v8.44,78.42
  Bottom 0.406: v8.44,78.42 8.44,76.2 17.02,76.2 17.02,73.82 24.96,73.82 24.96,84.93 56.07,84.93 56.07,88.11 61.15,88.11 61.15,86.84 69.41,86.84 69.41,86.2 75.12,86.2 75.12,89.22 79.88,89.22 79.88,92.71 86.87,92.71 86.87,95.09 89.09,95.09 89.09,102.23 104.97,102.23 E38.5
B_BRK_RQ  (via drill 0.81 pad 0.41)
  Top 0.406: v74.8,186.37 74.8,183.2 91,183.2 91,172.4 95.76,172.4 95.76,169.54 110.68,169.54 110.68,143.83 111.63,143.83 111.63,117.47 107.51,117.47 E38.9
  Bottom 0.406: H.B2 77.03,198.75 77.03,186.37 v74.8,186.37
B_DRIVE_STATUS_ER  (via drill 0.81 pad 0.41)
  Top 0.406: v94.17,142.56 94.17,144.78 95.44,144.78 E40.3
  Bottom 0.406: E53.3 17.97,118.11 33.84,118.11 33.84,121.44 43.05,121.44 43.05,129.54 61.47,129.54 61.47,132.4 72.26,132.4 72.26,134.3 78.3,134.3 78.3,141.29 91,141.29 91,142.56 v94.17,142.56
B_IO_PAUSE  (via drill 0.81 pad 0.41)
  Top 0.406: v103.7,76.83 103.7,68.74 100.84,68.74 100.84,48.1 91.95,48.1 91.95,41.91 85.92,41.91 E35.14
  ECO2 0.406: E34.3 133.54,152.88 143.7,152.88 143.7,84.61 142.43,84.61 142.43,74.77 103.7,74.77 v103.7,76.83
  Bottom 0.406: E51.3 34.16,70.33 42.73,70.33 42.73,69.06 54.16,69.06 75.44,69.37 75.44,70.96 80.84,70.96 80.84,67.94 84.33,67.94 84.33,71.6 88.14,71.6 88.14,74.45 93.85,74.45 93.85,78.42 100.84,78.42 100.84,76.83 v103.7,76.83
BDATA1  (via drill 0.81 pad 0.41)
  Top 0.406: E20.10 189.1,148.11 190.37,148.11 190.37,160.34 187.83,160.34 187.83,170.18 196.09,170.18 v196.09,183.51
  Bottom 0.406: H.T2 121.16,200.5 121.16,187.8 138.62,187.8 138.62,189.71 140.53,191.61 194.5,191.61 194.5,183.51 v196.09,183.51
BDATA10  (via drill 0.81)
  Top 0.406: v6.86,181.93 6.86,151.29 3.68,151.29 3.68,134.3 4.95,134.3 4.95,68.74 v7.18,68.9 | v58.93,82.87 58.93,79.69 59.88,79.69 59.88,71.91 58.61,71.91 E44.1
  Bottom 0.406: J.A2 4.64,201.77 4.64,181.93 v6.86,181.93 | v7.18,68.9 5.59,68.74 5.59,75.25 16.07,75.25 16.07,72.87 26.23,72.87 26.23,83.66 46.23,83.66 46.23,82.71 v58.93,82.87
BDATA11  (via drill 0.81 pad 0.41)
  Top 0.406: J.R1 45.59,199.39 45.59,193.99 44.64,193.99 44.64,188.12 54.16,188.12 54.16,186.37 63.37,186.37 63.37,178.59 56.07,178.59 v56.07,166.37
  Bottom 0.406: v56.07,166.37 57.34,166.37 57.34,165.58 60.52,165.58 60.52,163.04 73.53,163.04 E41.5
BMD0
  Top 0.406: E3.2 240.54,56.99 235.46,56.99 235.46,46.2 240.22,46.2 E2.2
BMD1
  Top 0.406: E3.3 243.08,55.72 237.68,55.72 E2.14
BMD2
  Top 0.406: E3.4 245.62,54.61 238.95,54.61 238.95,47.78 242.76,47.78 E2.3
BMD3
  Top 0.406: E2.13 240.22,53.34 248.16,53.34 E3.5
BMD4
  Top 0.406: E5.2 240.54,105.41 236.09,105.41 236.09,101.6 230.69,101.6 230.69,76.83 231.65,76.83 231.65,63.18 225.93,63.18 225.93,65.72 209.42,65.72 209.42,61.75 201.8,61.75 201.8,49.53 181.16,49.53 181.16,42.55 174.5,42.55 174.5,32.54 178.31,32.54 E15.2
BMD5
  Top 0.406: E15.14 175.77,41.59 182.12,41.59 182.12,48.74 202.75,48.74 202.75,60.8 210.38,60.8 210.38,64.45 224.98,64.45 224.98,62.23 232.6,62.23 232.6,78.11 231.97,78.11 231.97,100.49 243.08,100.49 E5.3
BMD6
  Top 0.406: E5.4 245.62,99.54 232.92,99.54 232.92,79.06 233.55,79.06 233.55,61.44 224.03,61.44 224.03,63.5 211.33,63.5 211.33,59.53 204.03,59.53 204.03,47.47 183.39,47.47 183.39,40.64 177.04,40.64 177.04,34.45 180.85,34.45 E15.3
  Bottom 0.406: W2W5.3 221.81,31.27 221.81,28.89 204.66,28.89 204.66,27.62 180.85,27.62 E15.3
BMD7
  Top 0.406: E5.5 248.16,98.58 233.87,98.58 233.87,80.01 234.5,80.01 234.5,60.48 222.76,60.48 222.76,62.23 212.28,62.23 212.28,58.58 204.98,58.58 204.98,46.2 184.34,46.2 184.34,39.37 178.31,39.37 E15.13
  Bottom 0.406: W1W4.1 218.95,36.2 218.95,34.13 212.91,34.13 212.91,39.05 201.17,39.05 201.17,40.96 178.31,40.96 E15.13
BMD8  (via drill 0.81 pad 0.41)
  Top 0.406: E42.2 64.33,34.45 60.2,34.45 60.2,45.24 56.71,45.24 56.71,66.04 56.07,66.04 56.07,86.52 v58.29,86.36
  Bottom 0.406: W3W6.1 226.88,22.86 215.77,22.86 192.28,22.7 166.88,22.7 166.88,21.11 139.89,21.11 139.89,26.04 128.46,26.04 128.46,27.62 118.62,27.62 118.62,28.26 106.23,28.26 106.23,26.04 64.33,26.04 E42.2 | v58.29,86.36 58.29,84.61 61.47,84.61 61.47,85.57 67.82,85.57 67.82,84.93 76.07,84.93 76.07,88.11 80.84,88.11 80.84,91.76 87.82,91.76 87.82,94.3 90.04,94.3 90.04,101.12 104.01,101.12 104.01,99.22 113.54,99.22 113.54,97.63 122.75,97.63 E32.2
BMD9  (via drill 0.81 pad 0.41)
  Top 0.406: E42.14 61.79,45.56 86.55,45.56 86.55,52.07 93.54,52.07 93.54,80.64 E37.1 91.63,80.64 v91.63,95.25
  Bottom 0.406: E32.3 125.29,96.36 112.27,96.36 112.27,97.95 102.74,97.95 102.74,99.85 91.63,99.85 v91.63,95.25
BMD10  (via drill 0.81 pad 0.41)
  Top 0.406: E42.3 66.87,30.64 65.59,30.64 65.59,43.02 88.77,43.02 88.77,49.85 98.62,49.85 98.62,76.52 97.98,76.52 97.98,83.34 99.25,83.34 E37.14 99.25,96.68 93.54,96.68 v93.54,98.11
  Bottom 0.406: E32.4 127.83,95.41 111,95.41 111,96.68 101.16,96.68 101.16,97.95 v93.54,98.11
BMD11  (via drill 0.81 pad 0.41)